# Altium project DA1_prj.PrjPcb (part 1 of 2)
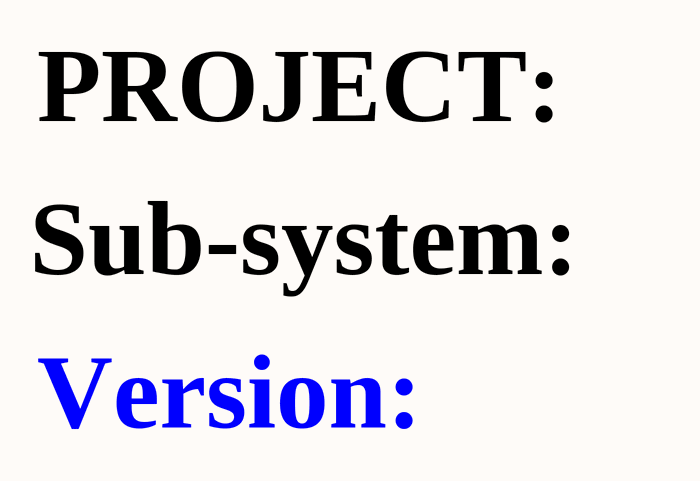
[diagram p0: COVER PAGE.SchDoc]
11 sheets, 279 parts. Net scope: flat (ports and power ports of the same name join across sheets).
Board file: PCB1.PcbDoc
Sheets:
  COVER PAGE.SchDoc
  INDEX.SchDoc
  STM32_PLC.SchDoc
  INPUT.SchDoc
  DIGTITAL.SchDoc
  DSDADC.SchDoc
  PULSE.SchDoc
  CAN.SchDoc
  SDADC.SchDoc
  DAC.SchDoc
  LED.SchDoc

## Sheet COVER PAGE.SchDoc: COVER PAGE
size 420 x 297 mm; Date: March 14; CheckedBy: ThS. Bùi Quốc Bảo; DrawnBy: Nguyễn Gia Huy; Revision: 1.0.0; SheetNumber: 1; SheetTotal: 6; MasterProject: STM32-PLC; Sub-system: DA1_prj.PrjPcb

### Notes on the sheet
- PROJECT:
- Sub-system:
- Version:
- Project:
- Design by:
- Sheet title:
- Sheet
- of
- Checked by:
- Approved by:
- Doc No:
- Revision:
- Size:
- Dates:
- A3

## Sheet INDEX.SchDoc: INDEX
size 420 x 297 mm; Date: March 14; CheckedBy: ThS. Bùi Quốc Bảo; DrawnBy: Nguyễn Gia Huy; Revision: V1.0; SheetNumber: 2; SheetTotal: 11; MasterProject: STM32 DEMO PCB; Sub-system: DA1_prj.PrjPcb
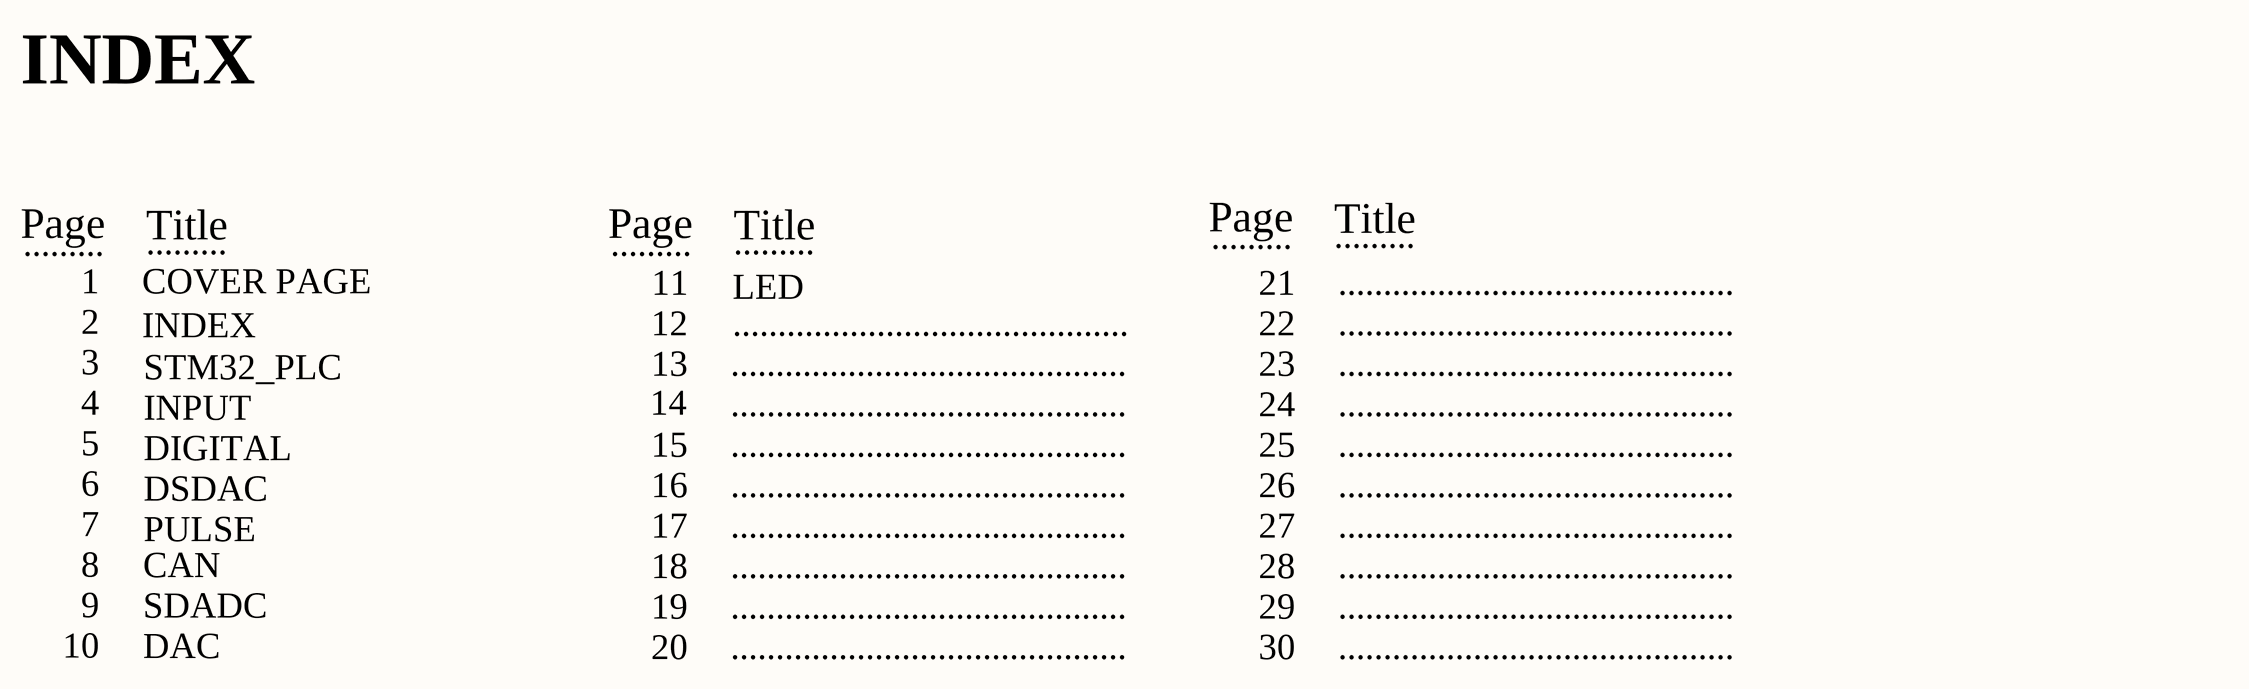
[diagram p1: INDEX.SchDoc]

### Notes on the sheet
- INDEX
- Page
- .........
- Title
- 1
- COVER PAGE
- 11
- LED
- 21
- ............................................
- 2
- 3
- STM32_PLC
- 12
- 13
- 22
- 23
- 4
- 5
- INPUT
- DIGITAL
- 14
- 15
- 24
- 25
- 6
- DSDAC
- 16
- 26
- 7
- 8
- CAN
- PULSE
- 17
- 18
- 27
- 28
- 9
- 10
- SDADC
- DAC
- 19
- 20
- 29
- 30
- Sub-system:
- Project:
- Design by:
- Sheet title:
- Sheet
- of
- Checked by:
- Approved by:
- Doc No:
- Revision:
- Size:
- Dates:
- A3

## Sheet STM32_PLC.SchDoc: STM32_PLC
size 420 x 297 mm; Date: March 14; CheckedBy: ThS. Bùi Quốc Bảo; DrawnBy: Nguyễn Gia Huy; Revision: V1.0; SheetNumber: 3; SheetTotal: 11; MasterProject: STM32-PLC; Sub-system: DA1_prj.PrjPcb
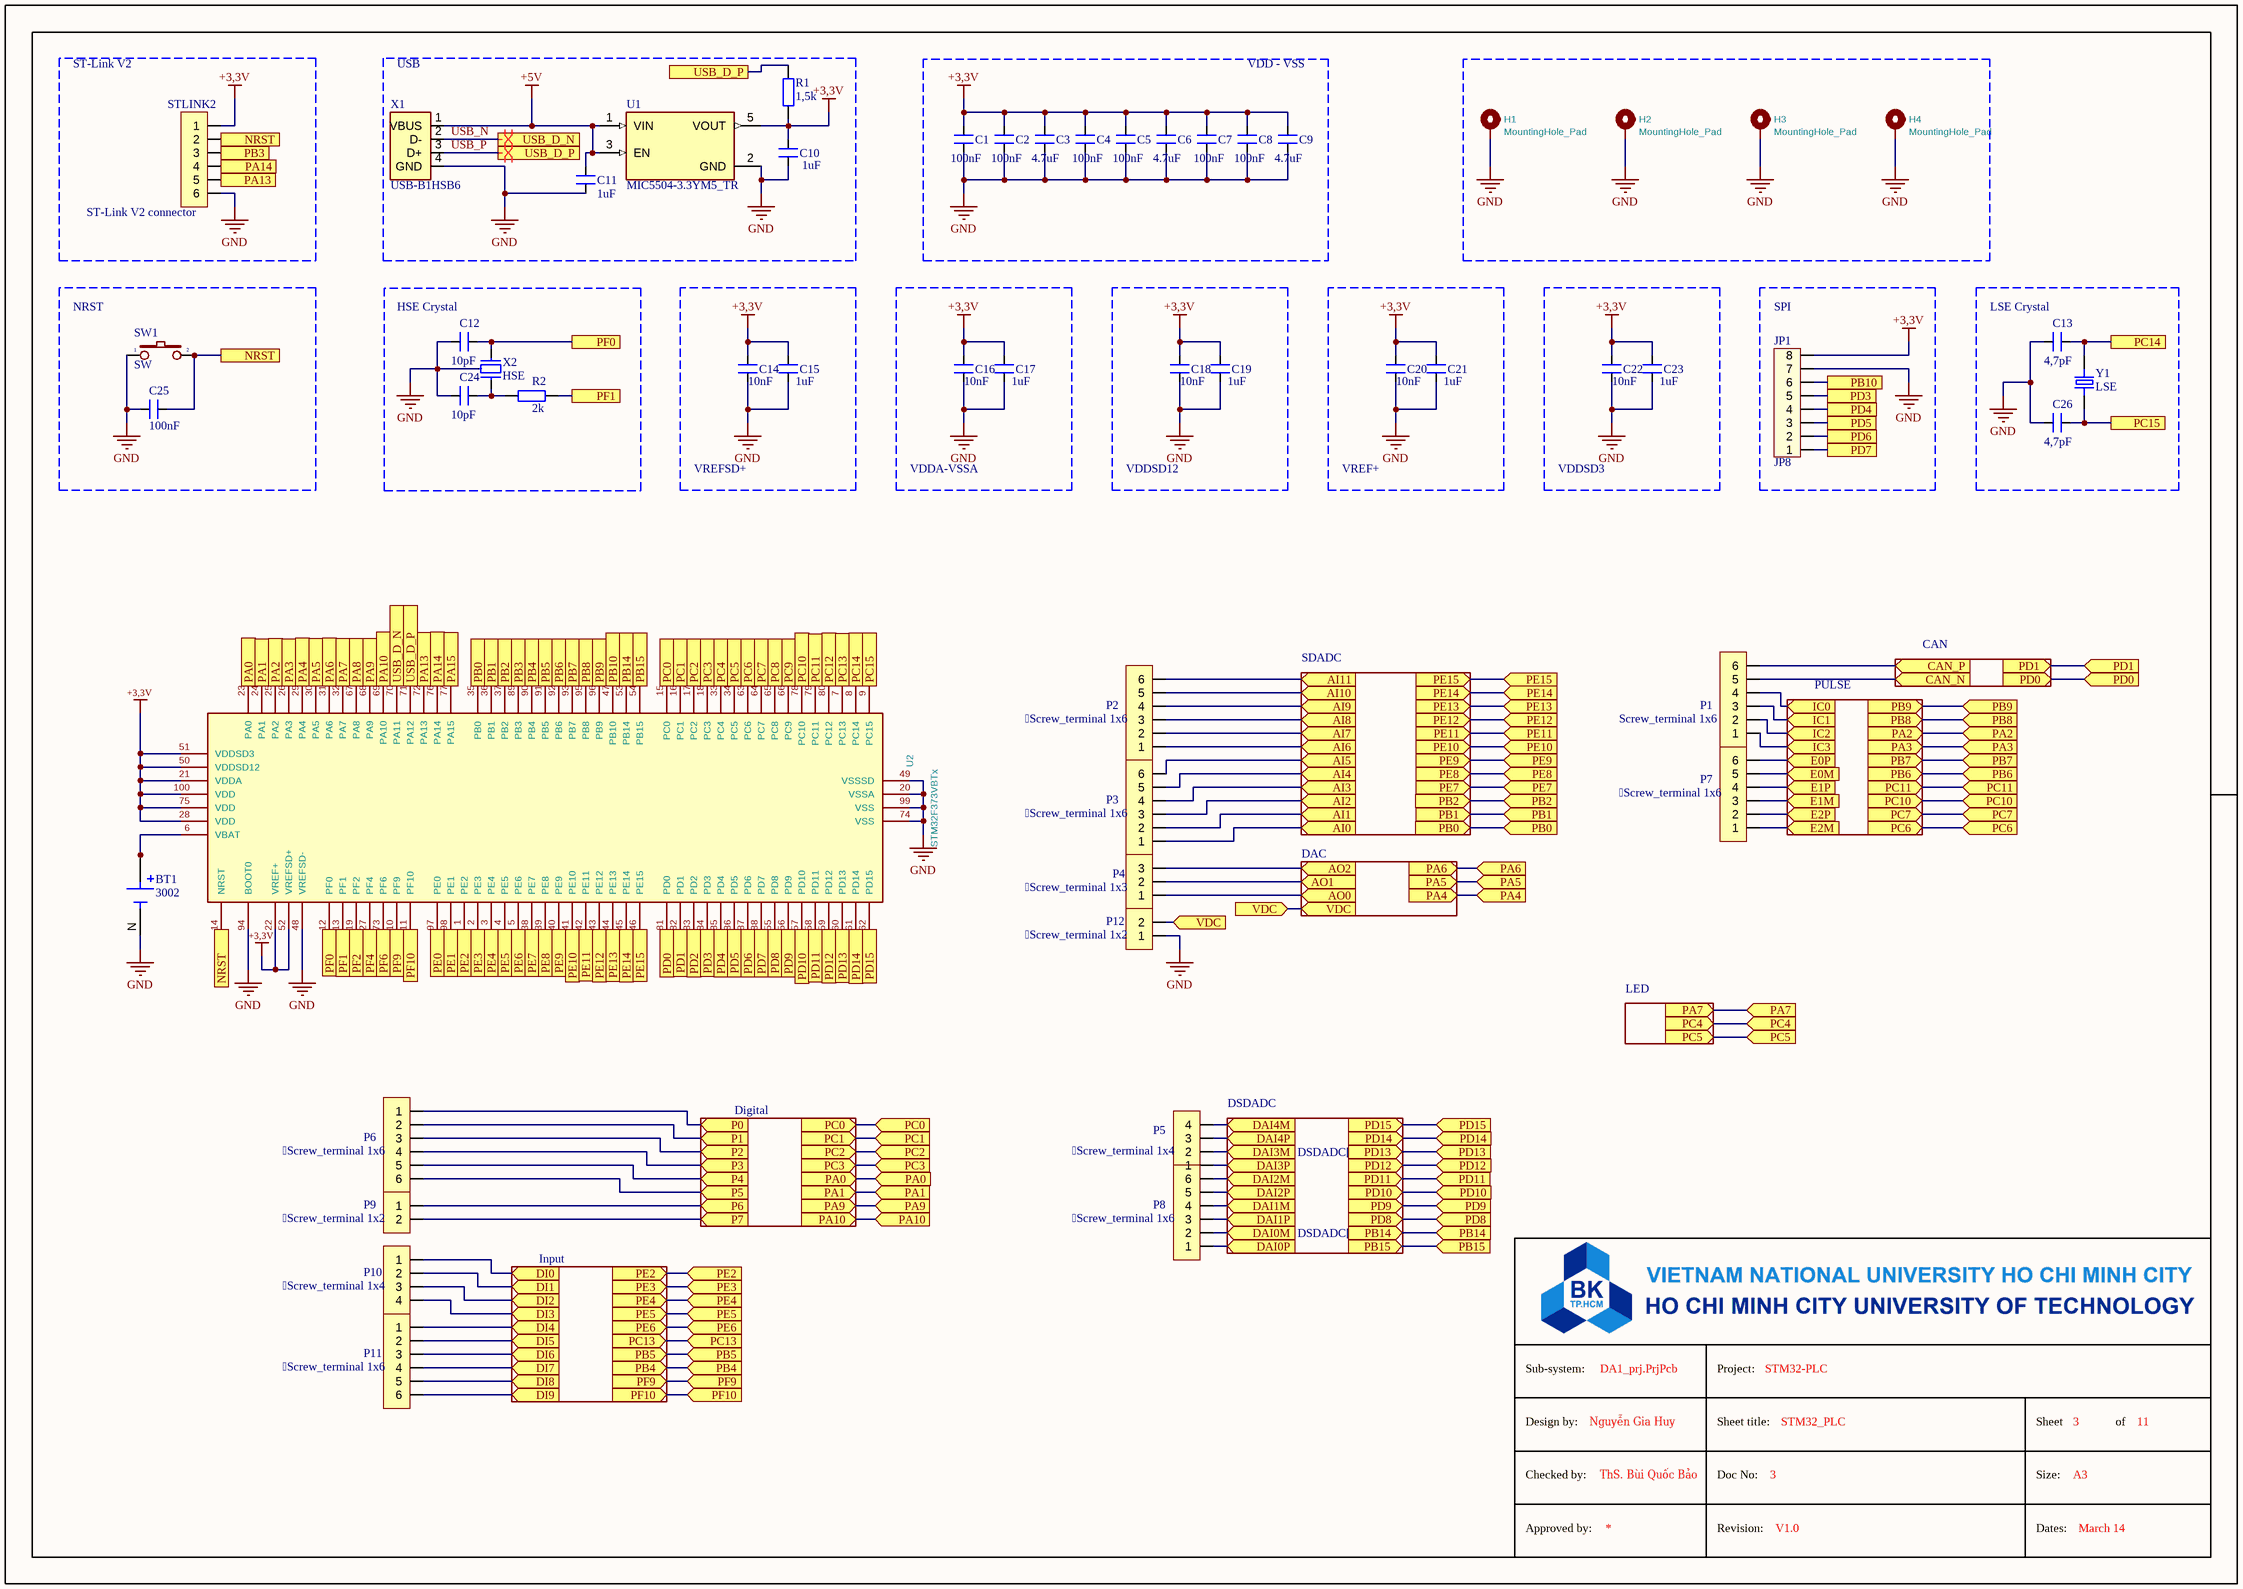
[diagram p2: STM32_PLC.SchDoc]

### Parts
BT1  3002  [BAT_3002]
C1  100nF  [FP-C0603C-CF-IPC_A]
C2  100nF  [FP-C0603C-CF-IPC_A]
C3  4.7uF  [FP-C0603C-CF-IPC_A]
C4  100nF  [FP-C0603C-CF-IPC_A]
C5  100nF  [FP-C0603C-CF-IPC_A]
C6  4.7uF  [FP-C0603C-CF-IPC_A]
C7  100nF  [FP-C0603C-CF-IPC_A]
C8  100nF  [FP-C0603C-CF-IPC_A]
C9  4.7uF  [FP-C0603C-CF-IPC_A]
C10  1uF  [FP-C0603C-CF-IPC_A]
C11  1uF  [FP-C0603C-CF-IPC_A]
C12  10pF  [FP-C0603C-CF-IPC_A]
C13  4,7pF  [FP-C0603C-CF-IPC_A]
C14  10nF  [FP-C0603C-CF-IPC_A]
C15  1uF  [FP-C0603C-CF-IPC_A]
C16  10nF  [FP-C0603C-CF-IPC_A]
C17  1uF  [FP-C0603C-CF-IPC_A]
C18  10nF  [FP-C0603C-CF-IPC_A]
C19  1uF  [FP-C0603C-CF-IPC_A]
C20  10nF  [FP-C0603C-CF-IPC_A]
C21  1uF  [FP-C0603C-CF-IPC_A]
C22  10nF  [FP-C0603C-CF-IPC_A]
C23  1uF  [FP-C0603C-CF-IPC_A]
C24  10pF  [FP-C0603C-CF-IPC_A]
C25  100nF  [FP-C0603C-CF-IPC_A]
C26  4,7pF  [FP-C0603C-CF-IPC_A]
H1  MountingHole_Pad  [MountingHole_2.7mm_M2.5_DIN965_Pad]
H2  MountingHole_Pad  [MountingHole_2.7mm_M2.5_DIN965_Pad]
H3  MountingHole_Pad  [MountingHole_2.7mm_M2.5_DIN965_Pad]
H4  MountingHole_Pad  [MountingHole_2.7mm_M2.5_DIN965_Pad]
JP1  JP8  [HDR/Header/8]
P1  Screw_terminal 1x6  [HDR/Terminal/6]
P2  Screw_terminal 1x6  [HDR/Terminal/6]
P3  Screw_terminal 1x6  [HDR/Terminal/6]
P4  Screw_terminal 1x3  [HDR/Terminal/3]
P5  Screw_terminal 1x4  [HDR/Terminal/4]
P6  Screw_terminal 1x6  [HDR/Terminal/6]
P7  Screw_terminal 1x6  [HDR/Terminal/6]
P8  Screw_terminal 1x6  [HDR/Terminal/6]
P9  Screw_terminal 1x2  [HDR/Terminal/2]
P10  Screw_terminal 1x4  [HDR/Terminal/4]
P11  Screw_terminal 1x6  [HDR/Terminal/6]
P12  Screw_terminal 1x2  [HDR/Terminal/2]
R1  1,5k  [tro smd 0603]
R2  2k  [tro smd 0603]
STLINK2  ST-Link V2 connector  [HDR/Header/6]
SW1  SW  [SW1-SMD]
U1  MIC5504-3.3YM5_TR  [SOT95P280X145-5N]
U2  STM32F373VBTx  [QFP50P1600X1600X160-100N]
X1  USB-B1HSB6  [OST_USB-B1HSB6]
X2  HSE  [XT3]
Y1  LSE  [XTAL_ECS-.327-7-34B-TR]

### Blocks framed on the sheet
ST-Link V2: STLINK2
USB: C10 C11 R1 U1 X1
VDD - VSS: C1-C9
NRST: C25 SW1
HSE Crystal: C12 C24 R2 X2
VREFSD+: C14 C15
VDDA-VSSA: C16 C17
VDDSD12: C18 C19
VREF+: C20 C21
VDDSD3: C22 C23
SPI: JP1
LSE Crystal: C13 C26 Y1

### Ports
AI0 (in, see SDADC[4C]), AI1 (in, see SDADC[4B]), AI2 (in, see SDADC[4B]), AI3 (in, see SDADC[4A]), AI4 (in, see SDADC[3C]), AI5 (in, see SDADC[3B]), AI6 (in, see SDADC[3B]), AI7 (in, see SDADC[3A]), AI8 (in, see SDADC[1C]), AI9 (in, see SDADC[1B]), AI10 (in, see SDADC[1B]), AI11 (in, see SDADC[1A]), AO0 (in, see DAC[3B]), AO1 (in, see DAC[3D]), AO2 (in, see DAC[5B]), CAN_N (in, see CAN[4B]), CAN_P (in, see CAN[4B]), DAI0M (in, see DSDADC[4B]), DAI0P (in, see DSDADC[4A]), DAI1M (in, see DSDADC[3C]), DAI1P (in, see DSDADC[3C]), DAI2M (in, see DSDADC[3A]), DAI2P (in, see DSDADC[3B]), DAI3M (in, see DSDADC[2C]), DAI3P (in, see DSDADC[2C]), DAI4M (in, see DSDADC[2A]), DAI4P (in, see DSDADC[2B]), DI0 (in, see INPUT[1C], INPUT[3D]), DI1 (in, see INPUT[1C], INPUT[3C]), DI2 (in, see INPUT[1C], INPUT[3B]), DI3 (in, see INPUT[1C], INPUT[3B]), DI4 (in, see INPUT[1B], INPUT[3A]), DI5 (in, see INPUT[1B], INPUT[2D]), DI6 (in, see INPUT[1B], INPUT[2C]), DI7 (in, see INPUT[1B], INPUT[2B]), DI8 (in, see INPUT[1B], INPUT[2B]), DI9 (in, see INPUT[1B], INPUT[2A]), E0M (in, see PULSE[3B]), E0P (in, see PULSE[3A]), E1M (in, see PULSE[3C]), E1P (in, see PULSE[3C]), E2M (in, see PULSE[5B]), E2P (in, see PULSE[5A]), IC0 (in, see PULSE[1A]), IC1 (in, see PULSE[1B]), IC2 (in, see PULSE[1C]), IC3 (in, see PULSE[1C]), NRST (in, see STM32_PLC[1A]), NRST (see STM32_PLC[1A], STM32_PLC[1C]), P0 (in, see DIGTITAL[2A]), P1 (in, see DIGTITAL[4B]), P2 (in, see DIGTITAL[4B]), P3 (in, see DIGTITAL[2B]), P4 (in, see DIGTITAL[2B]), P5 (in, see DIGTITAL[5A]), P6 (in, see DIGTITAL[4A]), P7 (in, see DIGTITAL[5B]), PA0 (in, see DIGTITAL[1C], STM32_PLC[1B], STM32_PLC[3C]), PA0 (in, see DIGTITAL[1C], STM32_PLC[3C]), PA1 (in, see DIGTITAL[4A], STM32_PLC[1B], STM32_PLC[3D]), PA1 (in, see DIGTITAL[4A], STM32_PLC[3D]), PA2 (in, see PULSE[2C], STM32_PLC[1B], STM32_PLC[6B]), PA2 (in, see PULSE[2C], STM32_PLC[6B]), PA3 (in, see PULSE[2C], STM32_PLC[1B], STM32_PLC[6B]), PA3 (in, see PULSE[2C], STM32_PLC[6B]), PA4 (in, see DAC[2B], STM32_PLC[1B], STM32_PLC[4C]), PA4 (in, see DAC[2B], STM32_PLC[4C]), PA5 (in, see DAC[2C], STM32_PLC[1B], STM32_PLC[4C]), PA5 (in, see DAC[2C], STM32_PLC[4C]), PA6 (in, see DAC[4B], STM32_PLC[1B], STM32_PLC[4C]), PA6 (in, see DAC[4B], STM32_PLC[4C]), PA7 (in, see LED[3B], STM32_PLC[1B], STM32_PLC[5C]), PA7 (in, see LED[3B], STM32_PLC[5C]), PA8 (in), PA9 (in, see DIGTITAL[3A], STM32_PLC[1B], STM32_PLC[3D]), PA9 (in, see DIGTITAL[3A], STM32_PLC[3D]), PA10 (in, see DIGTITAL[4B], STM32_PLC[2B], STM32_PLC[3D]), PA10 (in, see DIGTITAL[4B], STM32_PLC[3D]), PA13 (in, see STM32_PLC[1A]), PA13 (see STM32_PLC[2B]), PA14 (in, see STM32_PLC[1A]), PA14 (see STM32_PLC[2B]), PA15 (in), PB0 (in, see SDADC[5C], STM32_PLC[2B], STM32_PLC[4C]), PB0 (in, see SDADC[5C], STM32_PLC[2B], STM32_PLC[5C]), PB0 (in, see SDADC[5C], STM32_PLC[4C], STM32_PLC[5C]), PB1 (in, see SDADC[5B], STM32_PLC[2B], STM32_PLC[4C]), PB1 (in, see SDADC[5B], STM32_PLC[2B], STM32_PLC[5C]), PB1 (in, see SDADC[5B], STM32_PLC[4C], STM32_PLC[5C]), PB2 (in, see SDADC[5B], STM32_PLC[2B], STM32_PLC[4C]), PB2 (in, see SDADC[5B], STM32_PLC[2B], STM32_PLC[5C]), PB2 (in, see SDADC[5B], STM32_PLC[4C], STM32_PLC[5C]), PB3 (in, see STM32_PLC[1A]), PB3 (see STM32_PLC[2B]), PB4 (in, see INPUT[3B], STM32_PLC[2B], STM32_PLC[2D]), PB4 (in, see INPUT[3B], STM32_PLC[2D]), PB5 (in, see INPUT[3C], STM32_PLC[2B], STM32_PLC[2D]), PB5 (in, see INPUT[3C], STM32_PLC[2D]), PB6 (in, see PULSE[4B], STM32_PLC[2B], STM32_PLC[6B]), PB6 (in, see PULSE[4B], STM32_PLC[6B]), PB7 (in, see PULSE[4A], STM32_PLC[2B], STM32_PLC[6B]), PB7 (in, see PULSE[4A], STM32_PLC[6B]), PB8 (in, see PULSE[2B], STM32_PLC[2B], STM32_PLC[6B]), PB8 (in, see PULSE[2B], STM32_PLC[6B]), PB9 (in, see PULSE[2A], STM32_PLC[2B], STM32_PLC[6B]), PB9 (in, see PULSE[2A], STM32_PLC[6B]), PB10 (in, see STM32_PLC[5A]), PB10 (see STM32_PLC[2B]), PB14 (in, see DSDADC[5A], STM32_PLC[2B], STM32_PLC[4D]), PB14 (in, see DSDADC[5A], STM32_PLC[4D]), PB15 (in, see DSDADC[5B], STM32_PLC[2B], STM32_PLC[4D]), PB15 (in, see DSDADC[5B], STM32_PLC[4D]), PC0 (in, see DIGTITAL[1A], STM32_PLC[2B], STM32_PLC[3C]), PC0 (in, see DIGTITAL[1A], STM32_PLC[3C]), PC1 (in, see DIGTITAL[3B], STM32_PLC[2B], STM32_PLC[3C]), PC1 (in, see DIGTITAL[3B], STM32_PLC[3C]), PC2 (in, see DIGTITAL[3C], STM32_PLC[2B], STM32_PLC[3C]), PC2 (in, see DIGTITAL[3C], STM32_PLC[3C]), PC3 (in, see DIGTITAL[1B], STM32_PLC[2B], STM32_PLC[3C]), PC3 (in, see DIGTITAL[1B], STM32_PLC[3C]), PC4 (in, see LED[3B], STM32_PLC[2B], STM32_PLC[5C]), PC4 (in, see LED[3B], STM32_PLC[5C]), PC5 (in, see LED[3C], STM32_PLC[2B], STM32_PLC[5C]), PC5 (in, see LED[3C], STM32_PLC[5C]), PC6 (in, see PULSE[6B], STM32_PLC[2B], STM32_PLC[6C]), PC6 (in, see PULSE[6B], STM32_PLC[6C]), PC7 (in, see PULSE[6A], STM32_PLC[3B], STM32_PLC[6C]), PC7 (in, see PULSE[6A], STM32_PLC[6C]), PC8 (in), PC9 (in), PC10 (in, see PULSE[4C], STM32_PLC[3B], STM32_PLC[6C]), PC10 (in, see PULSE[4C], STM32_PLC[6C]), PC11 (in, see PULSE[4C], STM32_PLC[3B], STM32_PLC[6B]), PC11 (in, see PULSE[4C], STM32_PLC[6B]), PC12 (in), PC13 (in, see INPUT[3D], STM32_PLC[2D]), PC13 (in, see INPUT[3D], STM32_PLC[2D], STM32_PLC[3B]), PC14 (in, see STM32_PLC[6A]), PC14 (see STM32_PLC[3B]), PC15 (in, see STM32_PLC[6B]), PC15 (see STM32_PLC[3B]), PD0 (in, see CAN[2C], STM32_PLC[2C], STM32_PLC[6B]), PD0 (in, see CAN[2C], STM32_PLC[6B]), PD1 (in, see CAN[2C], STM32_PLC[2C], STM32_PLC[6B]), PD1 (in, see CAN[2C], STM32_PLC[6B]), PD2 (in), PD3 (in, see STM32_PLC[5A]), PD3 (see STM32_PLC[2C]), PD4 (in, see STM32_PLC[5B]), PD4 (see STM32_PLC[2C]), PD5 (in, see STM32_PLC[5B]), PD5 (see STM32_PLC[2C]), PD6 (in, see STM32_PLC[5B]), PD6 (see STM32_PLC[2C]), PD7 (in, see STM32_PLC[5B]), PD7 (see STM32_PLC[3C]), PD8 (in, see DSDADC[4C], STM32_PLC[3C], STM32_PLC[4D]), PD8 (in, see DSDADC[4C], STM32_PLC[4D]), PD9 (in, see DSDADC[4C], STM32_PLC[3C], STM32_PLC[4D]), PD9 (in, see DSDADC[4C], STM32_PLC[4D]), PD10 (in, see DSDADC[4B], STM32_PLC[3C], STM32_PLC[4D]), PD10 (in, see DSDADC[4B], STM32_PLC[4D]), PD11 (in, see DSDADC[4A], STM32_PLC[3C], STM32_PLC[4C]), PD11 (in, see DSDADC[4A], STM32_PLC[4C]), PD12 (in, see DSDADC[2C], STM32_PLC[3C], STM32_PLC[4C]), PD12 (in, see DSDADC[2C], STM32_PLC[4C]), PD13 (in, see DSDADC[2C], STM32_PLC[3C], STM32_PLC[4C]), PD13 (in, see DSDADC[2C], STM32_PLC[4C]), PD14 (in, see DSDADC[2B], STM32_PLC[3C], STM32_PLC[4C]), PD14 (in, see DSDADC[2B], STM32_PLC[4C]), PD15 (in, see DSDADC[2A], STM32_PLC[3C], STM32_PLC[4C]), PD15 (in, see DSDADC[2A], STM32_PLC[4C]), PE0 (in), PE1 (in), PE2 (in, see INPUT[4D], STM32_PLC[2C], STM32_PLC[2D]), PE2 (in, see INPUT[4D], STM32_PLC[2D]), PE3 (in, see INPUT[4C], STM32_PLC[2C], STM32_PLC[2D]), PE3 (in, see INPUT[4C], STM32_PLC[2D]), PE4 (in, see INPUT[4B], STM32_PLC[2C], STM32_PLC[2D]), PE4 (in, see INPUT[4B], STM32_PLC[2D]), PE5 (in, see INPUT[4B], STM32_PLC[2C], STM32_PLC[2D]), PE5 (in, see INPUT[4B], STM32_PLC[2D]), PE6 (in, see INPUT[4A], STM32_PLC[2C], STM32_PLC[2D]), PE6 (in, see INPUT[4A], STM32_PLC[2D]), PE7 (in, see SDADC[5A], STM32_PLC[2C], STM32_PLC[4B]), PE7 (in, see SDADC[5A], STM32_PLC[2C], STM32_PLC[5B]), PE7 (in, see SDADC[5A], STM32_PLC[4B], STM32_PLC[5B]), PE8 (in, see SDADC[3C], STM32_PLC[2C], STM32_PLC[4B]), PE8 (in, see SDADC[3C], STM32_PLC[2C], STM32_PLC[5B]), PE8 (in, see SDADC[3C], STM32_PLC[4B], STM32_PLC[5B]), PE9 (in, see SDADC[3B], STM32_PLC[2C], STM32_PLC[4B]), PE9 (in, see SDADC[3B], STM32_PLC[2C], STM32_PLC[5B]), PE9 (in, see SDADC[3B], STM32_PLC[4B], STM32_PLC[5B]), PE10 (in, see SDADC[3B], STM32_PLC[2C], STM32_PLC[4B]), PE10 (in, see SDADC[3B], STM32_PLC[2C], STM32_PLC[5B]), PE10 (in, see SDADC[3B], STM32_PLC[4B], STM32_PLC[5B]), PE11 (in, see SDADC[3A], STM32_PLC[2C], STM32_PLC[4B]), PE11 (in, see SDADC[3A], STM32_PLC[2C], STM32_PLC[5B]), PE11 (in, see SDADC[3A], STM32_PLC[4B], STM32_PLC[5B]), PE12 (in, see SDADC[2C], STM32_PLC[2C], STM32_PLC[4B]), PE12 (in, see SDADC[2C], STM32_PLC[2C], STM32_PLC[5B]), PE12 (in, see SDADC[2C], STM32_PLC[4B], STM32_PLC[5B]), PE13 (in, see SDADC[2B], STM32_PLC[2C], STM32_PLC[4B]), PE13 (in, see SDADC[2B], STM32_PLC[2C], STM32_PLC[5B]), PE13 (in, see SDADC[2B], STM32_PLC[4B], STM32_PLC[5B]), PE14 (in, see SDADC[2B], STM32_PLC[2C], STM32_PLC[4B]), PE14 (in, see SDADC[2B], STM32_PLC[2C], STM32_PLC[5B]), PE14 (in, see SDADC[2B], STM32_PLC[4B], STM32_PLC[5B]), PE15 (in, see SDADC[2A], STM32_PLC[2C], STM32_PLC[4B]), PE15 (in, see SDADC[2A], STM32_PLC[2C], STM32_PLC[5B]), PE15 (in, see SDADC[2A], STM32_PLC[4B], STM32_PLC[5B]), PF0 (in, see STM32_PLC[2A]), PF0 (see STM32_PLC[1C]), PF1 (in, see STM32_PLC[2A]), PF1 (see STM32_PLC[1C]), PF2 (in), PF4 (in), PF6 (in), PF9 (in, see INPUT[3B], STM32_PLC[2C], STM32_PLC[2D]), PF9 (in, see INPUT[3B], STM32_PLC[2D]), PF10 (in, see INPUT[3A], STM32_PLC[2C], STM32_PLC[2D]), PF10 (in, see INPUT[3A], STM32_PLC[2D]), USB_D_N (in, see STM32_PLC[2A]), USB_D_N (see STM32_PLC[2B]), USB_D_P (in, see STM32_PLC[2A]), USB_D_P (see STM32_PLC[2A], STM32_PLC[2B]), VDC (in, see DAC[1A], DAC[2A], DAC[3B], DAC[3C], DAC[5B], STM32_PLC[4C])

### Nets
+3,3V: C1.2 C2.2 C3.2 C4.2 C5.2 C6.2 C7.2 C8.2 C9.2 C10.2 C14.2 C15.2 C16.2 C17.2 C18.2 C19.2 C20.2 C21.2 C22.2 C23.2 JP1.8 R1.1 STLINK2.1 U1.5(VOUT) U2.21(VDDA) U2.22(VREF+) U2.28(VDD) U2.50(VDDSD12) U2.51(VDDSD3) U2.52(VREFSD+) U2.75(VDD) U2.100(VDD)
+5V: C11.2 U1.1(VIN) U1.3(EN) X1.1(VBUS)
GND: BT1.N(NEG) C1.1 C2.1 C3.1 C4.1 C5.1 C6.1 C7.1 C8.1 C9.1 C10.1 C11.1 C12.2 C13.2 C14.1 C15.1 C16.1 C17.1 C18.1 C19.1 C20.1 C21.1 C22.1 C23.1 C24.2 C25.2 C26.2 H1.1 H2.1 H3.1 H4.1 JP1.7 P12.1 STLINK2.6 SW1.1 U1.2(GND) U2.20(VSSA) U2.48(VREFSD-) U2.49(VSSSD) U2.74(VSS) U2.94(BOOT0) U2.99(VSS) X1.4(GND) X2.3
USB_N: U2.70(PA11) X1.2(D-) ; port USB_D_N
USB_P: R1.2 U2.71(PA12) X1.3(D+) ; port USB_D_P
VDC: P12.2 ; port VDC
NetBT1_P1: BT1.P1(POS) BT1.P2(POS) U2.6(VBAT)
NetC12_1: C12.1 U2.12(PF0) X2.1 ; port PF0
NetC13_1: C13.1 U2.8(PC14) Y1.2 ; port PC14
NetC24_1: C24.1 R2.2 X2.2
NetC25_1: C25.1 STLINK2.2 SW1.2 U2.14(NRST) ; port NRST
NetC26_1: C26.1 U2.9(PC15) Y1.1 ; port PC15
NetC27_2: P1.6 ; port CAN_P
NetC29_1: U2.81(PD0) ; port PD0
NetC31_2: U2.82(PD1) ; port PD1
NetC32_2: P1.5 ; port CAN_N
NetC34_1: U2.29(PA4) ; port PA4
NetC35_1: U2.31(PA6) ; port PA6
NetC36_1: U2.30(PA5) ; port PA5
NetD2_3: U2.62(PD15) ; port PD15
NetD3_3: U2.58(PD11) ; port PD11
NetD4_3: U2.53(PB14) ; port PB14
NetD5_3: U2.61(PD14) ; port PD14
NetD6_3: U2.57(PD10) ; port PD10
NetD7_3: U2.54(PB15) ; port PB15
NetD8_3: U2.60(PD13) ; port PD13
NetD9_3: U2.56(PD9) ; port PD9
NetD10_3: U2.59(PD12) ; port PD12
NetD11_3: U2.55(PD8) ; port PD8
NetD12_3: U2.46(PE15) ; port PE15
NetD13_3: U2.42(PE11) ; port PE11
NetD14_3: U2.38(PE7) ; port PE7
NetD15_3: U2.45(PE14) ; port PE14
NetD16_3: U2.41(PE10) ; port PE10
NetD17_3: U2.37(PB2) ; port PB2
NetD18_3: U2.44(PE13) ; port PE13
NetD19_3: U2.40(PE9) ; port PE9
NetD20_3: U2.36(PB1) ; port PB1
NetD21_3: U2.43(PE12) ; port PE12
NetD22_3: U2.39(PE8) ; port PE8
NetD23_3: U2.35(PB0) ; port PB0
NetF1_1: P6.1 ; port P0
NetF2_1: P9.1 ; port P6
NetF3_1: P6.6 ; port P5
NetF4_1: P6.4 ; port P3
NetF5_1: P6.2 ; port P1
NetF6_1: P9.2 ; port P7
NetF7_1: P6.5 ; port P4
NetF8_1: P6.3 ; port P2
NetF9_2: P5.4 ; port DAI4M
NetF10_2: P8.6 ; port DAI2M
NetF11_2: P8.1 ; port DAI0P
NetF12_2: P5.3 ; port DAI4P
NetF13_2: P8.5 ; port DAI2P
NetF14_2: P8.2 ; port DAI0M
NetF15_2: P5.2 ; port DAI3M
NetF16_2: P8.4 ; port DAI1M
NetF17_2: P5.1 ; port DAI3P
NetF18_2: P8.3 ; port DAI1P
NetF19_2: P2.6 ; port AI11
NetF20_2: P2.2 ; port AI7
NetF21_2: P3.4 ; port AI3
NetF22_2: P2.5 ; port AI10
NetF23_2: P2.1 ; port AI6
NetF24_2: P3.3 ; port AI2
NetF25_2: P2.4 ; port AI9
NetF26_2: P3.6 ; port AI5
NetF27_2: P3.2 ; port AI1
NetF28_2: P2.3 ; port AI8
NetF29_2: P3.5 ; port AI4
NetF30_2: P3.1 ; port AI0
NetJP1_1: JP1.1 U2.88(PD7) ; port PD7
NetJP1_2: JP1.2 U2.87(PD6) ; port PD6
NetJP1_3: JP1.3 U2.86(PD5) ; port PD5
NetJP1_4: JP1.4 U2.85(PD4) ; port PD4
NetJP1_5: JP1.5 U2.84(PD3) ; port PD3
NetJP1_6: JP1.6 U2.47(PB10) ; port PB10
NetP1_1: P1.1 ; port IC3
NetP1_2: P1.2 ; port IC2
NetP1_3: P1.3 ; port IC1
NetP1_4: P1.4 ; port IC0
NetP4_1: P4.1 ; port AO0
NetP4_2: P4.2 ; port AO1
NetP4_3: P4.3 ; port AO2
NetP7_1: P7.1 ; port E2M
NetP7_2: P7.2 ; port E2P
NetP7_3: P7.3 ; port E1M
NetP7_4: P7.4 ; port E1P
NetP7_5: P7.5 ; port E0M
NetP7_6: P7.6 ; port E0P
NetP10_1: P10.1 ; port DI0
NetP10_2: P10.2 ; port DI1
NetP10_3: P10.3 ; port DI2
NetP10_4: P10.4 ; port DI3
NetP11_1: P11.1 ; port DI4
NetP11_2: P11.2 ; port DI5
NetP11_3: P11.3 ; port DI6
NetP11_4: P11.4 ; port DI7
NetP11_5: P11.5 ; port DI8
NetP11_6: P11.6 ; port DI9
NetR2_1: R2.1 U2.13(PF1) ; port PF1
NetR8_1: U2.11(PF10) ; port PF10
NetR10_1: U2.5(PE6) ; port PE6
NetR12_1: U2.10(PF9) ; port PF9
NetR14_1: U2.4(PE5) ; port PE5
NetR16_1: U2.90(PB4) ; port PB4
NetR18_1: U2.3(PE4) ; port PE4
NetR20_1: U2.91(PB5) ; port PB5
NetR22_1: U2.2(PE3) ; port PE3
NetR24_1: U2.7(PC13) ; port PC13
NetR26_1: U2.1(PE2) ; port PE2
NetR27_1: U2.15(PC0) ; port PC0
NetR28_1: U2.68(PA9) ; port PA9
NetR29_1: U2.24(PA1) ; port PA1
NetR33_1: U2.18(PC3) ; port PC3
NetR34_1: U2.16(PC1) ; port PC1
NetR35_1: U2.69(PA10) ; port PA10
NetR39_1: U2.23(PA0) ; port PA0
NetR40_1: U2.17(PC2) ; port PC2
NetR122_1: U2.32(PA7) ; port PA7
NetR123_1: U2.33(PC4) ; port PC4
NetR124_1: U2.34(PC5) ; port PC5
NetSTLINK2_3: STLINK2.3 U2.89(PB3) ; port PB3
NetSTLINK2_4: STLINK2.4 U2.76(PA14) ; port PA14
NetSTLINK2_5: STLINK2.5 U2.72(PA13) ; port PA13
NetU2_19: U2.19(PF2) ; port PF2
NetU2_25: U2.25(PA2) ; port PA2
NetU2_26: U2.26(PA3) ; port PA3
NetU2_27: U2.27(PF4) ; port PF4
NetU2_63: U2.63(PC6) ; port PC6
NetU2_64: U2.64(PC7) ; port PC7
NetU2_65: U2.65(PC8) ; port PC8
NetU2_66: U2.66(PC9) ; port PC9
NetU2_67: U2.67(PA8) ; port PA8
NetU2_73: U2.73(PF6) ; port PF6
NetU2_77: U2.77(PA15) ; port PA15
NetU2_78: U2.78(PC10) ; port PC10
NetU2_79: U2.79(PC11) ; port PC11
NetU2_80: U2.80(PC12) ; port PC12
NetU2_83: U2.83(PD2) ; port PD2
NetU2_92: U2.92(PB6) ; port PB6
NetU2_93: U2.93(PB7) ; port PB7
NetU2_95: U2.95(PB8) ; port PB8
NetU2_96: U2.96(PB9) ; port PB9
NetU2_97: U2.97(PE0) ; port PE0
NetU2_98: U2.98(PE1) ; port PE1

### Layout directives
differential pair: USB_N, USB_P

### Notes on the sheet
- SDADC
- CAN
- PULSE
- DAC
- LED
- Digital
- (near P5) DSDADC
- Input
- Sub-system:
- Project:
- Design by:
- Sheet title:
- Sheet
- of
- Checked by:
- Approved by:
- Doc No:
- Revision:
- Size:
- Dates:
- A3

### Library data of the parts
BT1 = 3002: Battery Holder: SMT, 1 Coin Cell, 20mm, PhosBronze/Tin-Nickel | Keystone Electronics 3002; MF: Keystone Electronics Corp.; SnapEDA_Link: https://www.snapeda.com/parts/3002/Keystone/view-part/?ref=snap; Package: NON STANDARD-2 Keystone; Value: *; MP: 3002; Check_prices: https://www.snapeda.com/parts/3002/Keystone/view-part/?ref=eda
C1-C26 = CN-SEMI-DIP: Capacitor (Semiconductor SIM Model); Value: 104; LatestRevisionDate: 17-Jul-2002; LatestRevisionNote: Re-released for DXP Platform.; PackageReference: C1206; Publisher: Altium Limited
JP1 = Header8: Connector 8; Value: Connector 8
P1-P3 P6-P8 P11 STLINK2 = Header 6: Header, 6-Pin
P4 = Header 3: Header, 3-Pin
P5 P10 = Header 4: Header, 4-Pin
P9 P12 = Header 2: Header, 2-Pin
R1 R2 = Tro 0603 1% 10k: RES; Chung_Loai: Dán; Don_Vi: Con; So_Chan: 2; Ten_Linh_Kien: Trở 0603 1% 10k; Ma_Hang: MH006333; Kieu_Chan: *
SW1 = SW2: Switch button 2 pin; Value: SW chip 2 pin
U1 = MIC5504-3.3YM5_TR: Linear Voltage Regulator IC Positive Fixed 1 Output 300mA SOT-23-5; MF: Microchip; MP: MIC5504-3.3YM5 TR; SnapEDA_Link: https://www.snapeda.com/parts/MIC5504-3.3YM5%20TR/Microchip/view-part/?ref=snap; Package: SOT-23 Microchip; Value: *; Check_prices: https://www.snapeda.com/parts/MIC5504-3.3YM5%20TR/Microchip/view-part/?ref=eda
X1 = USB-B1HSB6: USB-B (USB TYPE-B) - Receptacle Connector 4 Position Through Hole, Right Angle; MF: On Shore; Check_prices: https://www.snapeda.com/parts/USB-B1HSB6/On+Shore+Technology+Inc./view-part/?ref=eda; Value: *; Purchase-URL: https://pricing.snapeda.com/search/part/USB-B1HSB6/?ref=eda; Price: None; MP: USB-B1HSB6; SnapEDA_Link: https://www.snapeda.com/parts/USB-B1HSB6/On+Shore+Technology+Inc./view-part/?ref=snap; Availability: In Stock; Package: None
X2 = XT3: Crystal For all Crystal 2pin.; Value: 4Mhz
Y1 = ECS-.327-7-34B-TR: 32.768 kHz Â±20ppm Crystal 7pF 70 kOhms 2-SMD, No Lead; MF: ECS Inc.; SnapEDA_Link: https://www.snapeda.com/parts/ECS-.327-7-34B-TR/ECS/view-part/?ref=snap; Package: ECX-31B-34B-2 ECS; Value: *; MP: ECS-.327-7-34B-TR; Check_prices: https://www.snapeda.com/parts/ECS-.327-7-34B-TR/ECS/view-part/?ref=eda
H1-H4 = MountingHole_Pad: Value: MountingHole_Pad; Footprint: MountingHole:MountingHole_2.7mm_M2.5_DIN965_Pad
U2 = STM32F373VBTx: Value: STM32F373VBTx; Footprint: Package_QFP:LQFP-100_14x14mm_P0.5mm

## Sheet INPUT.SchDoc: INPUT
size 420 x 297 mm; Date: March 14; CheckedBy: ThS. Bùi Quốc Bảo; DrawnBy: Nguyễn Gia Huy; Revision: V1.0; SheetNumber: 4; SheetTotal: 11; MasterProject: STM32-PLC; Sub-system: DA1_prj.PrjPcb
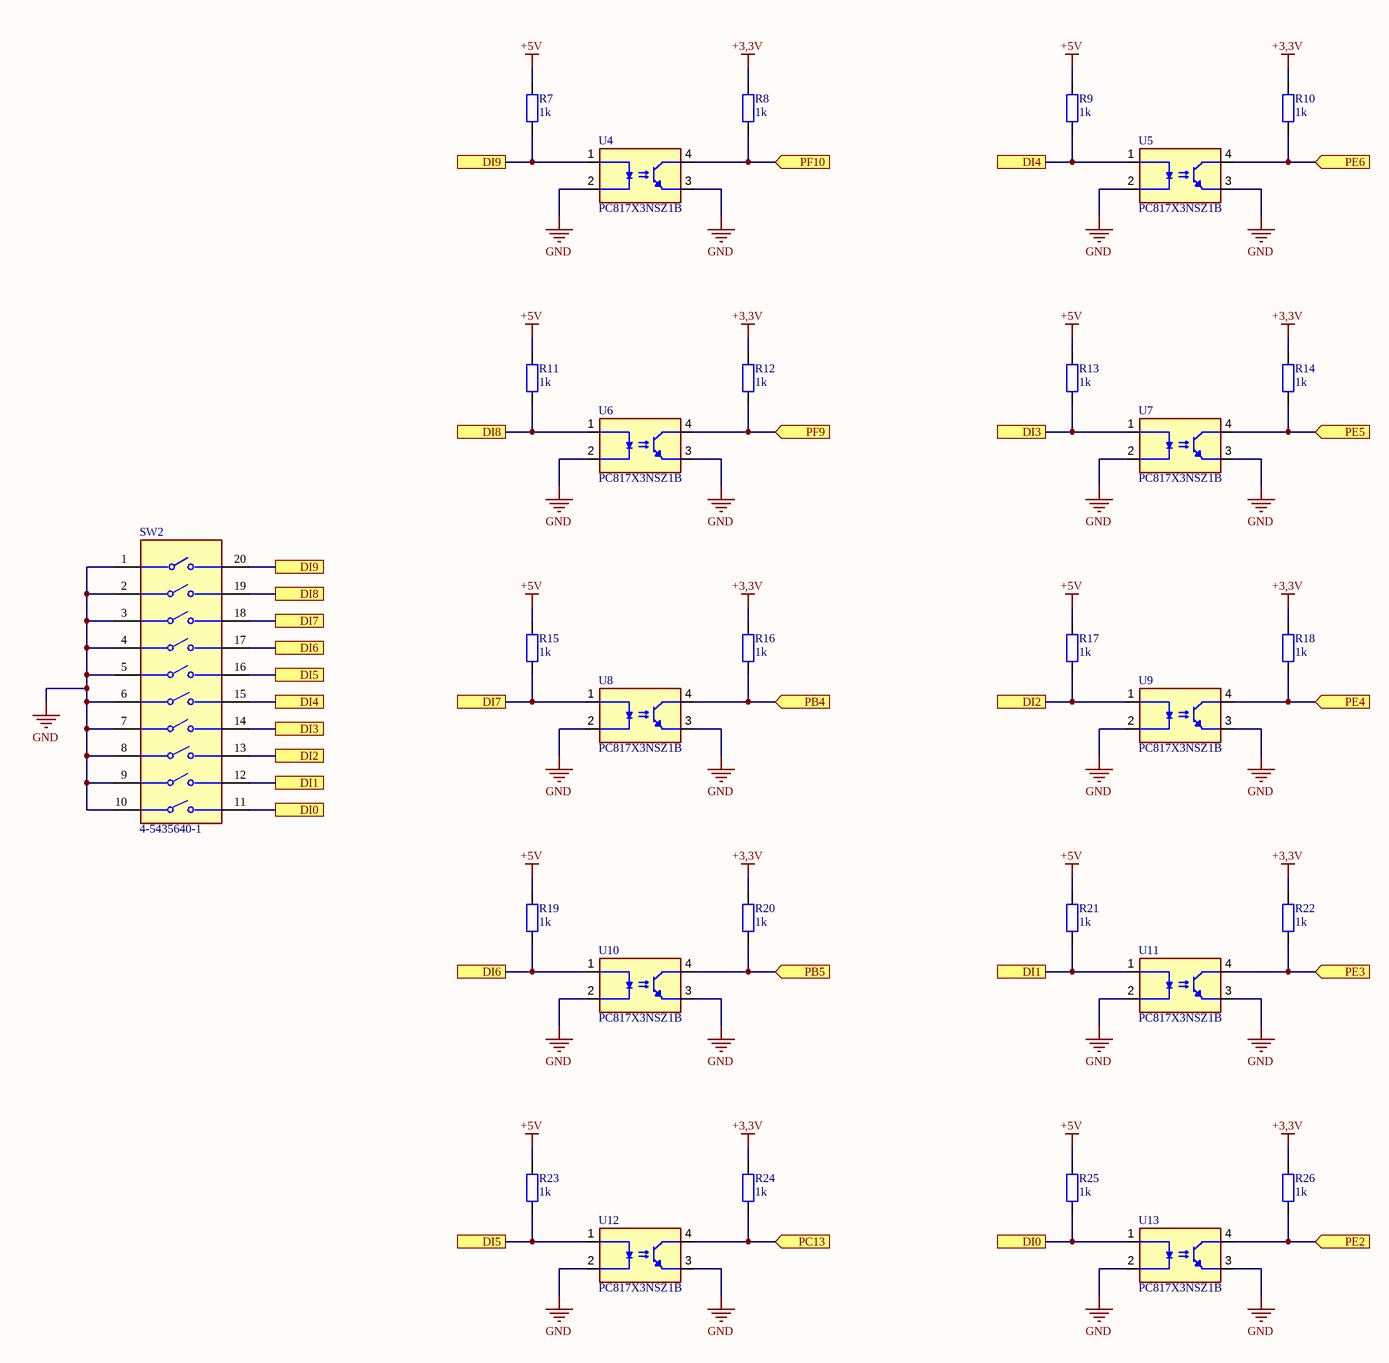
[diagram p3: INPUT.SchDoc]

### Parts
R7  1k  [tro smd 0603]
R8  1k  [tro smd 0603]
R9  1k  [tro smd 0603]
R10  1k  [tro smd 0603]
R11  1k  [tro smd 0603]
R12  1k  [tro smd 0603]
R13  1k  [tro smd 0603]
R14  1k  [tro smd 0603]
R15  1k  [tro smd 0603]
R16  1k  [tro smd 0603]
R17  1k  [tro smd 0603]
R18  1k  [tro smd 0603]
R19  1k  [tro smd 0603]
R20  1k  [tro smd 0603]
R21  1k  [tro smd 0603]
R22  1k  [tro smd 0603]
R23  1k  [tro smd 0603]
R24  1k  [tro smd 0603]
R25  1k  [tro smd 0603]
R26  1k  [tro smd 0603]
SW2  4-5435640-1  [FP-4-5435640-1-MFG]
U4  PC817X3NSZ1B  [DIP762W50P254L495H455Q4]
U5  PC817X3NSZ1B  [DIP762W50P254L495H455Q4]
U6  PC817X3NSZ1B  [DIP762W50P254L495H455Q4]
U7  PC817X3NSZ1B  [DIP762W50P254L495H455Q4]
U8  PC817X3NSZ1B  [DIP762W50P254L495H455Q4]
U9  PC817X3NSZ1B  [DIP762W50P254L495H455Q4]
U10  PC817X3NSZ1B  [DIP762W50P254L495H455Q4]
U11  PC817X3NSZ1B  [DIP762W50P254L495H455Q4]
U12  PC817X3NSZ1B  [DIP762W50P254L495H455Q4]
U13  PC817X3NSZ1B  [DIP762W50P254L495H455Q4]

### Ports
DI0 (see INPUT[1C], STM32_PLC[2D]), DI0 (see INPUT[3D], STM32_PLC[2D]), DI1 (see INPUT[1C], STM32_PLC[2D]), DI1 (see INPUT[3C], STM32_PLC[2D]), DI2 (see INPUT[1C], STM32_PLC[2D]), DI2 (see INPUT[3B], STM32_PLC[2D]), DI3 (see INPUT[1C], STM32_PLC[2D]), DI3 (see INPUT[3B], STM32_PLC[2D]), DI4 (see INPUT[1B], STM32_PLC[2D]), DI4 (see INPUT[3A], STM32_PLC[2D]), DI5 (see INPUT[1B], STM32_PLC[2D]), DI5 (see INPUT[2D], STM32_PLC[2D]), DI6 (see INPUT[1B], STM32_PLC[2D]), DI6 (see INPUT[2C], STM32_PLC[2D]), DI7 (see INPUT[1B], STM32_PLC[2D]), DI7 (see INPUT[2B], STM32_PLC[2D]), DI8 (see INPUT[1B], STM32_PLC[2D]), DI8 (see INPUT[2B], STM32_PLC[2D]), DI9 (see INPUT[1B], STM32_PLC[2D]), DI9 (see INPUT[2A], STM32_PLC[2D]), PB4 (in, see STM32_PLC[2B], STM32_PLC[2D]), PB5 (in, see STM32_PLC[2B], STM32_PLC[2D]), PC13 (in, see STM32_PLC[2D], STM32_PLC[3B]), PE2 (in, see STM32_PLC[2C], STM32_PLC[2D]), PE3 (in, see STM32_PLC[2C], STM32_PLC[2D]), PE4 (in, see STM32_PLC[2C], STM32_PLC[2D]), PE5 (in, see STM32_PLC[2C], STM32_PLC[2D]), PE6 (in, see STM32_PLC[2C], STM32_PLC[2D]), PF9 (in, see STM32_PLC[2C], STM32_PLC[2D]), PF10 (in, see STM32_PLC[2C], STM32_PLC[2D])

### Nets
+3,3V: R8.2 R10.2 R12.2 R14.2 R16.2 R18.2 R20.2 R22.2 R24.2 R26.2
+5V: R7.2 R9.2 R11.2 R13.2 R15.2 R17.2 R19.2 R21.2 R23.2 R25.2
GND: SW2.1 SW2.2 SW2.3 SW2.4 SW2.5 SW2.6 SW2.7 SW2.8 SW2.9 SW2.10 U4.2(CATHODE) U4.3(EMITTER) U5.2(CATHODE) U5.3(EMITTER) U6.2(CATHODE) U6.3(EMITTER) U7.2(CATHODE) U7.3(EMITTER) U8.2(CATHODE) U8.3(EMITTER) U9.2(CATHODE) U9.3(EMITTER) U10.2(CATHODE) U10.3(EMITTER) U11.2(CATHODE) U11.3(EMITTER) U12.2(CATHODE) U12.3(EMITTER) U13.2(CATHODE) U13.3(EMITTER)
NetP10_1: R25.1 SW2.11 U13.1(ANODE) ; port DI0
NetP10_2: R21.1 SW2.12 U11.1(ANODE) ; port DI1
NetP10_3: R17.1 SW2.13 U9.1(ANODE) ; port DI2
NetP10_4: R13.1 SW2.14 U7.1(ANODE) ; port DI3
NetP11_1: R9.1 SW2.15 U5.1(ANODE) ; port DI4
NetP11_2: R23.1 SW2.16 U12.1(ANODE) ; port DI5
NetP11_3: R19.1 SW2.17 U10.1(ANODE) ; port DI6
NetP11_4: R15.1 SW2.18 U8.1(ANODE) ; port DI7
NetP11_5: R11.1 SW2.19 U6.1(ANODE) ; port DI8
NetP11_6: R7.1 SW2.20 U4.1(ANODE) ; port DI9
NetR8_1: R8.1 U4.4(COLLECTOR) ; port PF10
NetR10_1: R10.1 U5.4(COLLECTOR) ; port PE6
NetR12_1: R12.1 U6.4(COLLECTOR) ; port PF9
NetR14_1: R14.1 U7.4(COLLECTOR) ; port PE5
NetR16_1: R16.1 U8.4(COLLECTOR) ; port PB4
NetR18_1: R18.1 U9.4(COLLECTOR) ; port PE4
NetR20_1: R20.1 U10.4(COLLECTOR) ; port PB5
NetR22_1: R22.1 U11.4(COLLECTOR) ; port PE3
NetR24_1: R24.1 U12.4(COLLECTOR) ; port PC13
NetR26_1: R26.1 U13.4(COLLECTOR) ; port PE2

### Notes on the sheet
- Sub-system:
- Project:
- Design by:
- Sheet title:
- Sheet
- of
- Checked by:
- Approved by:
- Doc No:
- Revision:
- Size:
- Dates:
- A3

### Library data of the parts
R7-R26 = Tro 0603 1% 10k: as R1 on sheet STM32_PLC; Kieu_Chan: *
SW2 = CMP-03400-000018-1: SWITCH ROCKER DIP SPST 60MA 5V; Number of Circuits: 10; Contact Post Length: 0.14inch; Washable: Yes; Contact Current Rating: 1A; Voltage Rating (DC): 40V; Sealable: Yes (With); Pitch: 0.1inch; Terminal Pitch: 2.54mm; Height: 0.34inch; Contact Plating: Gold; Mount: Through Hole; Orientation: Straight; Type: Switch; RoHS Compliant: Yes; Contact Material: Copper Alloy; Housing Material: Polyester; Package Quantity: 11; Termination: PC Pins; ELV: Compliant; Packaging: Rail/Tube; Actuator Type: Rocker; Housing Color: Blue; Min Operating Temperature: -55°C; Max Operating Temperature: 105°C; Length: 27.43mm; Lead Free: Lead Free; Radiation Hardening: No; Series: 7100; Number of Positions: 10; Throw Configuration: SPST
U4-U13 = PC817X3NSZ1B: Optoisolator Transistor Output - 1 Channel 4-DIP; MF: Sharp Microelectronics; SnapEDA_Link: https://www.snapeda.com/parts/PC817X3NSZ1B/Sharp+Microelectronics/view-part/?ref=snap; Price: None; Purchase-URL: https://pricing.snapeda.com/search/part/PC817X3NSZ1B/?ref=eda; Check_prices: https://www.snapeda.com/parts/PC817X3NSZ1B/Sharp+Microelectronics/view-part/?ref=eda; MP: PC817X3NSZ1B; Value: *; Availability: In Stock; Package: DIP-4 Sharp Microelectronics

## Sheet DIGTITAL.SchDoc: DIGITAL
size 420 x 297 mm; Date: March 14; CheckedBy: ThS. Bùi Quốc Bảo; DrawnBy: Nguyễn Gia Huy; Revision: V1.0; SheetNumber: 5; SheetTotal: 11; MasterProject: STM32-PLC; Sub-system: DA1_prj.PrjPcb
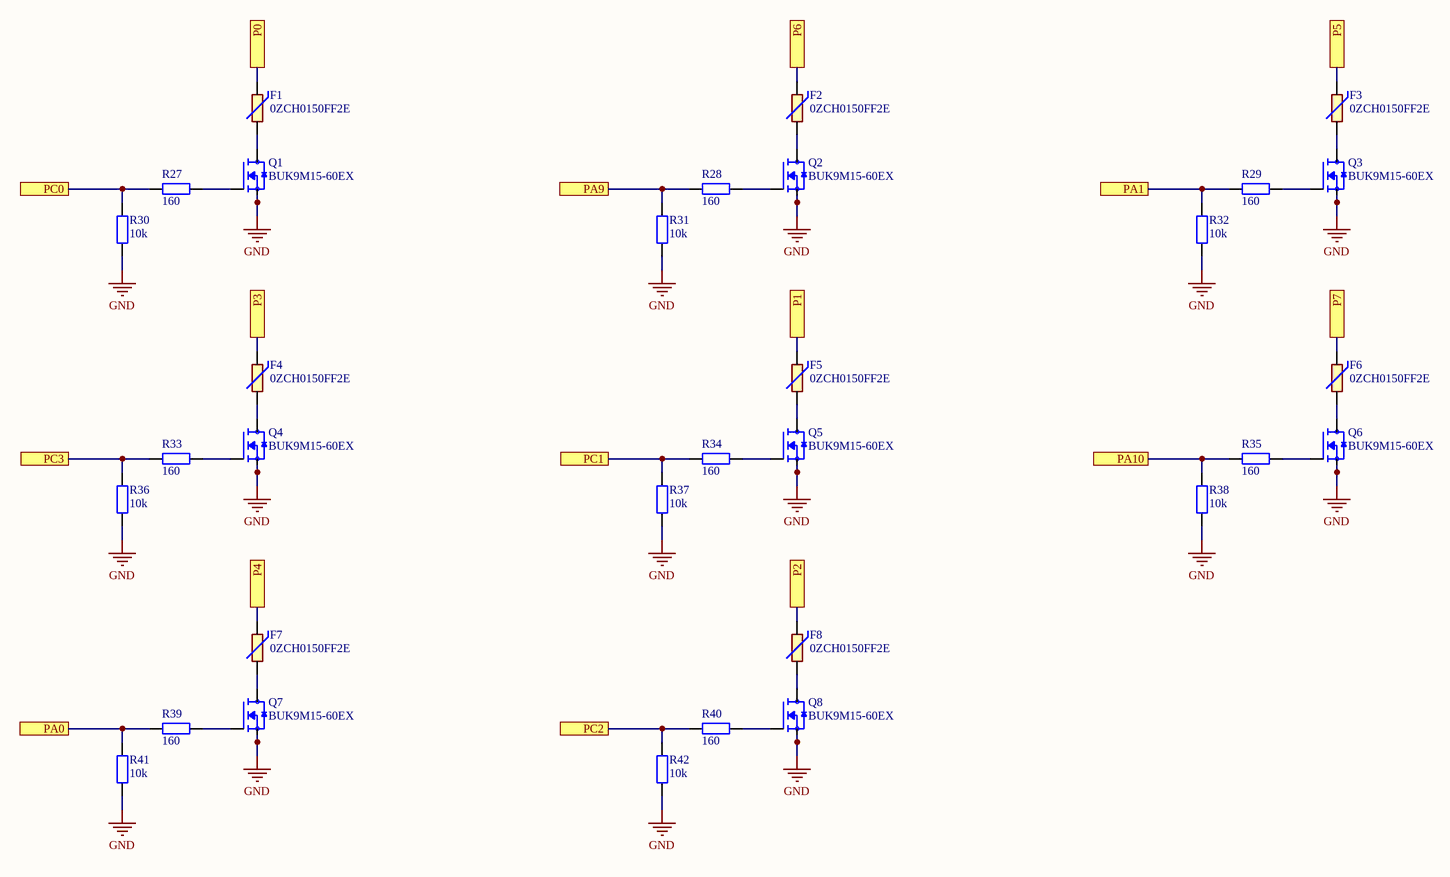
[diagram p4: DIGTITAL.SchDoc]

### Parts
F1  0ZCH0150FF2E  [FUSC3225X90N]
F2  0ZCH0150FF2E  [FUSC3225X90N]
F3  0ZCH0150FF2E  [FUSC3225X90N]
F4  0ZCH0150FF2E  [FUSC3225X90N]
F5  0ZCH0150FF2E  [FUSC3225X90N]
F6  0ZCH0150FF2E  [FUSC3225X90N]
F7  0ZCH0150FF2E  [FUSC3225X90N]
F8  0ZCH0150FF2E  [FUSC3225X90N]
Q1  BUK9M15-60EX  [TRANS_BUK9M15-60EX]
Q2  BUK9M15-60EX  [TRANS_BUK9M15-60EX]
Q3  BUK9M15-60EX  [TRANS_BUK9M15-60EX]
Q4  BUK9M15-60EX  [TRANS_BUK9M15-60EX]
Q5  BUK9M15-60EX  [TRANS_BUK9M15-60EX]
Q6  BUK9M15-60EX  [TRANS_BUK9M15-60EX]
Q7  BUK9M15-60EX  [TRANS_BUK9M15-60EX]
Q8  BUK9M15-60EX  [TRANS_BUK9M15-60EX]
R27  160  [tro smd 0603]
R28  160  [tro smd 0603]
R29  160  [tro smd 0603]
R30  10k  [tro smd 0603]
R31  10k  [tro smd 0603]
R32  10k  [tro smd 0603]
R33  160  [tro smd 0603]
R34  160  [tro smd 0603]
R35  160  [tro smd 0603]
R36  10k  [tro smd 0603]
R37  10k  [tro smd 0603]
R38  10k  [tro smd 0603]
R39  160  [tro smd 0603]
R40  160  [tro smd 0603]
R41  10k  [tro smd 0603]
R42  10k  [tro smd 0603]

### Ports
P0 (see STM32_PLC[2C]), P1 (see STM32_PLC[2C]), P2 (see STM32_PLC[2C]), P3 (see STM32_PLC[2C]), P4 (see STM32_PLC[2C]), P5 (see STM32_PLC[2D]), P6 (see STM32_PLC[2D]), P7 (see STM32_PLC[2D]), PA0 (see STM32_PLC[1B], STM32_PLC[3C]), PA1 (see STM32_PLC[1B], STM32_PLC[3D]), PA9 (see STM32_PLC[1B], STM32_PLC[3D]), PA10 (see STM32_PLC[2B], STM32_PLC[3D]), PC0 (see STM32_PLC[2B], STM32_PLC[3C]), PC1 (see STM32_PLC[2B], STM32_PLC[3C]), PC2 (see STM32_PLC[2B], STM32_PLC[3C]), PC3 (see STM32_PLC[2B], STM32_PLC[3C])

### Nets
GND: Q1.1(S) Q1.2(S) Q1.3(S) Q2.1(S) Q2.2(S) Q2.3(S) Q3.1(S) Q3.2(S) Q3.3(S) Q4.1(S) Q4.2(S) Q4.3(S) Q5.1(S) Q5.2(S) Q5.3(S) Q6.1(S) Q6.2(S) Q6.3(S) Q7.1(S) Q7.2(S) Q7.3(S) Q8.1(S) Q8.2(S) Q8.3(S) R30.1 R31.1 R32.1 R36.1 R37.1 R38.1 R41.1 R42.1
NetF1_1: F1.1 ; port P0
NetF1_2: F1.2 Q1.5(D)
NetF2_1: F2.1 ; port P6
NetF2_2: F2.2 Q2.5(D)
NetF3_1: F3.1 ; port P5
NetF3_2: F3.2 Q3.5(D)
NetF4_1: F4.1 ; port P3
NetF4_2: F4.2 Q4.5(D)
NetF5_1: F5.1 ; port P1
NetF5_2: F5.2 Q5.5(D)
NetF6_1: F6.1 ; port P7
NetF6_2: F6.2 Q6.5(D)
NetF7_1: F7.1 ; port P4
NetF7_2: F7.2 Q7.5(D)
NetF8_1: F8.1 ; port P2
NetF8_2: F8.2 Q8.5(D)
NetQ1_4: Q1.4(G) R27.2
NetQ2_4: Q2.4(G) R28.2
NetQ3_4: Q3.4(G) R29.2
NetQ4_4: Q4.4(G) R33.2
NetQ5_4: Q5.4(G) R34.2
NetQ6_4: Q6.4(G) R35.2
NetQ7_4: Q7.4(G) R39.2
NetQ8_4: Q8.4(G) R40.2
NetR27_1: R27.1 R30.2 ; port PC0
NetR28_1: R28.1 R31.2 ; port PA9
NetR29_1: R29.1 R32.2 ; port PA1
NetR33_1: R33.1 R36.2 ; port PC3
NetR34_1: R34.1 R37.2 ; port PC1
NetR35_1: R35.1 R38.2 ; port PA10
NetR39_1: R39.1 R41.2 ; port PA0
NetR40_1: R40.1 R42.2 ; port PC2

### Notes on the sheet
- Sub-system:
- Project:
- Design by:
- Sheet title:
- Sheet
- of
- Checked by:
- Approved by:
- Doc No:
- Revision:
- Size:
- Dates:
- A3

### Library data of the parts
F1-F8 = 0ZCH0150FF2E: 1210 SMT PPTC | 1.50 Ih | 6V; MF: Bel Fuse; SnapEDA_Link: https://www.snapeda.com/parts/0ZCH0150FF2E/Bel+Circuit+Protection/view-part/?ref=snap; Package: Package; Value: *; MP: 0ZCH0150FF2E; Check_prices: https://www.snapeda.com/parts/0ZCH0150FF2E/Bel+Circuit+Protection/view-part/?ref=eda
Q1-Q8 = BUK9M15-60EX: Bá»™ chuyá»ƒn Ä‘á»•i N-Channel 60 V 47A (Tc) 75W (Tc) gáº¯n bá» máº·t LFPAK33; MF: Nexperia USA; SnapEDA_Link: https://www.snapeda.com/parts/BUK9M15-60EX/Nexperia/view-part/?ref=snap; Package: LFPAK33-8 Nexperia USA Inc.; Value: *; MP: BUK9M15-60EX; Check_prices: https://www.snapeda.com/parts/BUK9M15-60EX/Nexperia/view-part/?ref=eda
R27-R42 = Tro 0603 1% 10k: as R1 on sheet STM32_PLC; Kieu_Chan: *

## Sheet DSDADC.SchDoc: DSDADC
size 420 x 297 mm; Date: March 14; CheckedBy: ThS. Bùi Quốc Bảo; DrawnBy: Nguyễn Gia Huy; Revision: V1.0; SheetNumber: 6; SheetTotal: 11; MasterProject: STM32-PLC; Sub-system: DA1_prj.PrjPcb
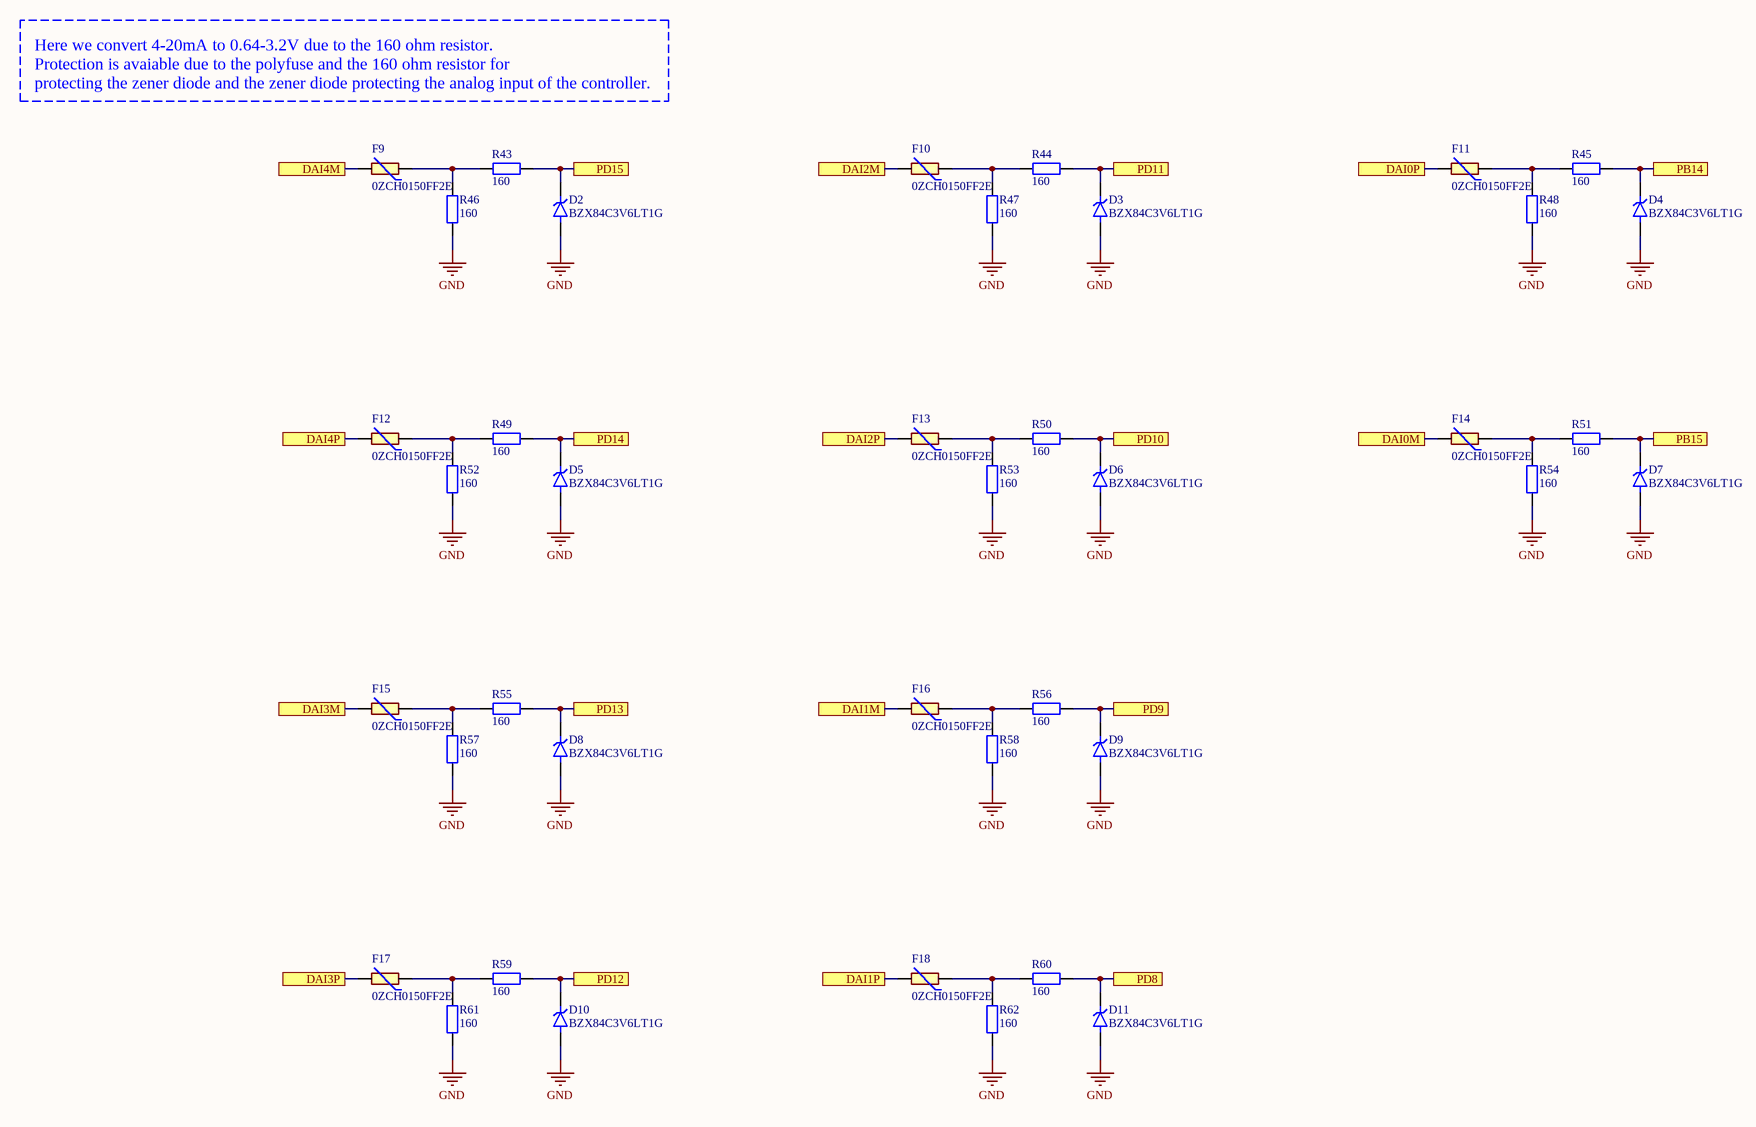
[diagram p5: DSDADC.SchDoc]

### Parts
D2  BZX84C3V6LT1G  [SOT95P240X111-3N]
D3  BZX84C3V6LT1G  [SOT95P240X111-3N]
D4  BZX84C3V6LT1G  [SOT95P240X111-3N]
D5  BZX84C3V6LT1G  [SOT95P240X111-3N]
D6  BZX84C3V6LT1G  [SOT95P240X111-3N]
D7  BZX84C3V6LT1G  [SOT95P240X111-3N]
D8  BZX84C3V6LT1G  [SOT95P240X111-3N]
D9  BZX84C3V6LT1G  [SOT95P240X111-3N]
D10  BZX84C3V6LT1G  [SOT95P240X111-3N]
D11  BZX84C3V6LT1G  [SOT95P240X111-3N]
F9  0ZCH0150FF2E  [FUSC3225X90N]
F10  0ZCH0150FF2E  [FUSC3225X90N]
F11  0ZCH0150FF2E  [FUSC3225X90N]
F12  0ZCH0150FF2E  [FUSC3225X90N]
F13  0ZCH0150FF2E  [FUSC3225X90N]
F14  0ZCH0150FF2E  [FUSC3225X90N]
F15  0ZCH0150FF2E  [FUSC3225X90N]
F16  0ZCH0150FF2E  [FUSC3225X90N]
F17  0ZCH0150FF2E  [FUSC3225X90N]
F18  0ZCH0150FF2E  [FUSC3225X90N]
R43  160  [tro smd 0603]
R44  160  [tro smd 0603]
R45  160  [tro smd 0603]
R46  160  [tro smd 0603]
R47  160  [tro smd 0603]
R48  160  [tro smd 0603]
R49  160  [tro smd 0603]
R50  160  [tro smd 0603]
R51  160  [tro smd 0603]
R52  160  [tro smd 0603]
R53  160  [tro smd 0603]
R54  160  [tro smd 0603]
R55  160  [tro smd 0603]
R56  160  [tro smd 0603]
R57  160  [tro smd 0603]
R58  160  [tro smd 0603]
R59  160  [tro smd 0603]
R60  160  [tro smd 0603]
R61  160  [tro smd 0603]
R62  160  [tro smd 0603]

### Ports
DAI0M (see STM32_PLC[4D]), DAI0P (see STM32_PLC[4D]), DAI1M (see STM32_PLC[4D]), DAI1P (see STM32_PLC[4D]), DAI2M (see STM32_PLC[4C]), DAI2P (see STM32_PLC[4D]), DAI3M (see STM32_PLC[4C]), DAI3P (see STM32_PLC[4C]), DAI4M (see STM32_PLC[4C]), DAI4P (see STM32_PLC[4C]), PB14 (see STM32_PLC[2B], STM32_PLC[4D]), PB15 (see STM32_PLC[2B], STM32_PLC[4D]), PD8 (see STM32_PLC[3C], STM32_PLC[4D]), PD9 (see STM32_PLC[3C], STM32_PLC[4D]), PD10 (see STM32_PLC[3C], STM32_PLC[4D]), PD11 (see STM32_PLC[3C], STM32_PLC[4C]), PD12 (see STM32_PLC[3C], STM32_PLC[4C]), PD13 (see STM32_PLC[3C], STM32_PLC[4C]), PD14 (see STM32_PLC[3C], STM32_PLC[4C]), PD15 (see STM32_PLC[3C], STM32_PLC[4C])

### Nets
GND: D2.1(A) D3.1(A) D4.1(A) D5.1(A) D6.1(A) D7.1(A) D8.1(A) D9.1(A) D10.1(A) D11.1(A) R46.1 R47.1 R48.1 R52.1 R53.1 R54.1 R57.1 R58.1 R61.1 R62.1
NetD2_3: D2.3(K) R43.2 ; port PD15
NetD3_3: D3.3(K) R44.2 ; port PD11
NetD4_3: D4.3(K) R45.2 ; port PB14
NetD5_3: D5.3(K) R49.2 ; port PD14
NetD6_3: D6.3(K) R50.2 ; port PD10
NetD7_3: D7.3(K) R51.2 ; port PB15
NetD8_3: D8.3(K) R55.2 ; port PD13
NetD9_3: D9.3(K) R56.2 ; port PD9
NetD10_3: D10.3(K) R59.2 ; port PD12
NetD11_3: D11.3(K) R60.2 ; port PD8
NetF9_1: F9.1 R43.1 R46.2
NetF9_2: F9.2 ; port DAI4M
NetF10_1: F10.1 R44.1 R47.2
NetF10_2: F10.2 ; port DAI2M
NetF11_1: F11.1 R45.1 R48.2
NetF11_2: F11.2 ; port DAI0P
NetF12_1: F12.1 R49.1 R52.2
NetF12_2: F12.2 ; port DAI4P
NetF13_1: F13.1 R50.1 R53.2
NetF13_2: F13.2 ; port DAI2P
NetF14_1: F14.1 R51.1 R54.2
NetF14_2: F14.2 ; port DAI0M
NetF15_1: F15.1 R55.1 R57.2
NetF15_2: F15.2 ; port DAI3M
NetF16_1: F16.1 R56.1 R58.2
NetF16_2: F16.2 ; port DAI1M
NetF17_1: F17.1 R59.1 R61.2
NetF17_2: F17.2 ; port DAI3P
NetF18_1: F18.1 R60.1 R62.2
NetF18_2: F18.2 ; port DAI1P

### Notes on the sheet
- Here we convert 4-20mA to 0.64-3.2V due to the 160 ohm resistor.
  Protection is avaiable due to the polyfuse and the 160 ohm resistor for
  protecting the zener diode and the zener diode protecting the analog input of the controller.
- Sub-system:
- Project:
- Design by:
- Sheet title:
- Sheet
- of
- Checked by:
- Approved by:
- Doc No:
- Revision:
- Size:
- Dates:
- A3

### Library data of the parts
F9-F18 = 0ZCH0150FF2E: as F1 on sheet DIGTITAL; SnapEDA_Link: https://www.snapeda.com/parts/0ZCH0150FF2E/Bel+Circuit+Protection/view-part/?ref=snap; Package: Package; Value: *; MP: 0ZCH0150FF2E; Check_prices: https://www.snapeda.com/parts/0ZCH0150FF2E/Bel+Circuit+Protection/view-part/?ref=eda
R43-R62 = Tro 0603 1% 10k: as R1 on sheet STM32_PLC; Kieu_Chan: *
D2-D11 = BZX84C3V6LT1G: Package: None; Price: None; Value: *; MP: BZX84C3V6LT1G; Availability: Unavailable

## Sheet PULSE.SchDoc: PULSE
size 420 x 297 mm; Date: March 14; CheckedBy: ThS. Bùi Quốc Bảo; DrawnBy: Nguyễn Gia Huy; Revision: V1.0; SheetNumber: 7; SheetTotal: 11; MasterProject: STM32-PLC; Sub-system: DA1_prj.PrjPcb
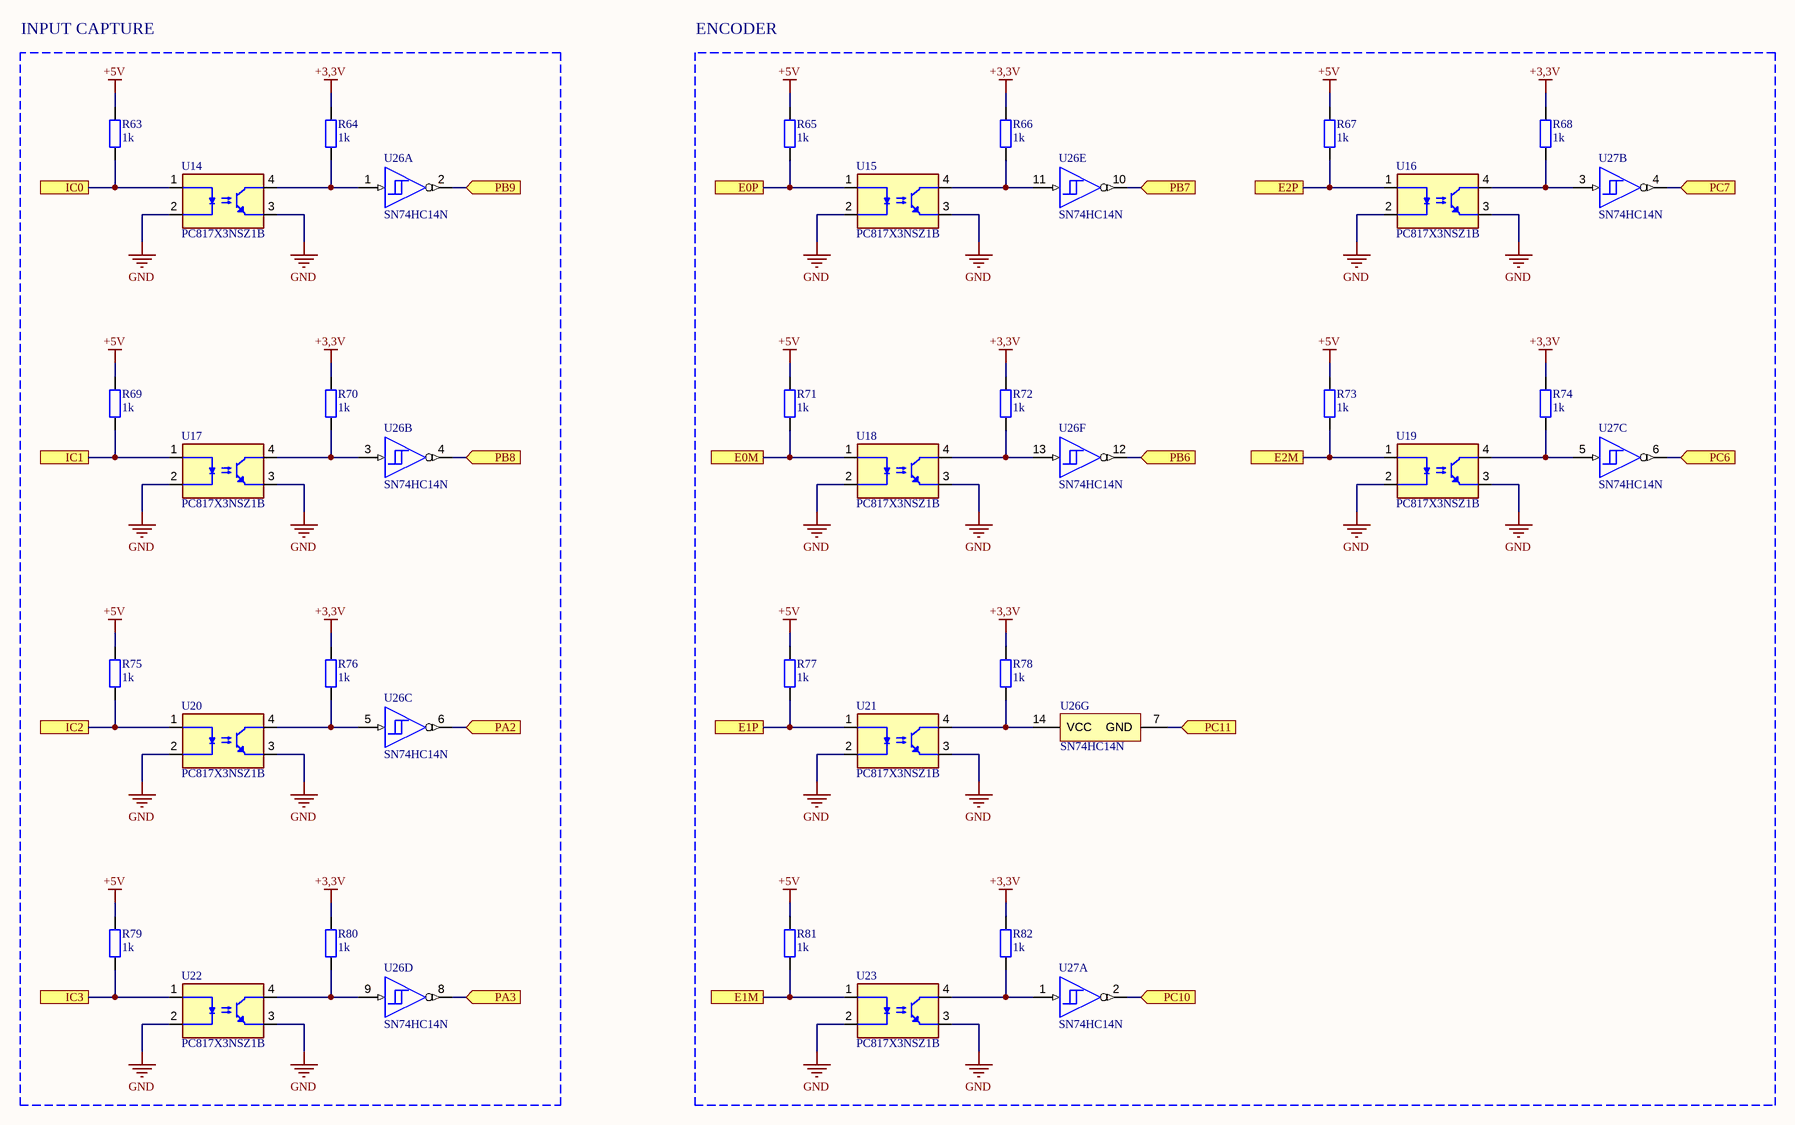
[diagram p6: PULSE.SchDoc]

### Parts
R63  1k  [tro smd 0603]
R64  1k  [tro smd 0603]
R65  1k  [tro smd 0603]
R66  1k  [tro smd 0603]
R67  1k  [tro smd 0603]
R68  1k  [tro smd 0603]
R69  1k  [tro smd 0603]
R70  1k  [tro smd 0603]
R71  1k  [tro smd 0603]
R72  1k  [tro smd 0603]
R73  1k  [tro smd 0603]
R74  1k  [tro smd 0603]
R75  1k  [tro smd 0603]
R76  1k  [tro smd 0603]
R77  1k  [tro smd 0603]
R78  1k  [tro smd 0603]
R79  1k  [tro smd 0603]
R80  1k  [tro smd 0603]
R81  1k  [tro smd 0603]
R82  1k  [tro smd 0603]
U14  PC817X3NSZ1B  [DIP762W50P254L495H455Q4]
U15  PC817X3NSZ1B  [DIP762W50P254L495H455Q4]
U16  PC817X3NSZ1B  [DIP762W50P254L495H455Q4]
U17  PC817X3NSZ1B  [DIP762W50P254L495H455Q4]
U18  PC817X3NSZ1B  [DIP762W50P254L495H455Q4]
U19  PC817X3NSZ1B  [DIP762W50P254L495H455Q4]
U20  PC817X3NSZ1B  [DIP762W50P254L495H455Q4]
U21  PC817X3NSZ1B  [DIP762W50P254L495H455Q4]
U22  PC817X3NSZ1B  [DIP762W50P254L495H455Q4]
U23  PC817X3NSZ1B  [DIP762W50P254L495H455Q4]
U26  SN74HC14N  [N0014A]  (parts A,B,C,D,E,F,G of 7)
U27  SN74HC14N  [N0014A]  (parts A,B,C of 7)

### Blocks framed on the sheet
INPUT CAPTURE: R63 R64 R69 R70 R75 R76 R79 R80 U14 U17 U20 U22 U26
ENCODER: R65-R68 R71-R74 R77 R78 R81 R82 U15 U16 U18 U19 U21 U23 U26 U27

### Ports
E0M (see STM32_PLC[5B]), E0P (see STM32_PLC[5B]), E1M (see STM32_PLC[5C]), E1P (see STM32_PLC[5B]), E2M (see STM32_PLC[5C]), E2P (see STM32_PLC[5C]), IC0 (see STM32_PLC[5B]), IC1 (see STM32_PLC[5B]), IC2 (see STM32_PLC[5B]), IC3 (see STM32_PLC[5B]), PA2 (in, see STM32_PLC[1B], STM32_PLC[6B]), PA3 (in, see STM32_PLC[1B], STM32_PLC[6B]), PB6 (in, see STM32_PLC[2B], STM32_PLC[6B]), PB7 (in, see STM32_PLC[2B], STM32_PLC[6B]), PB8 (in, see STM32_PLC[2B], STM32_PLC[6B]), PB9 (in, see STM32_PLC[2B], STM32_PLC[6B]), PC6 (in, see STM32_PLC[2B], STM32_PLC[6C]), PC7 (in, see STM32_PLC[3B], STM32_PLC[6C]), PC10 (in, see STM32_PLC[3B], STM32_PLC[6C]), PC11 (in, see STM32_PLC[3B], STM32_PLC[6B])

### Nets
+3,3V: R64.2 R66.2 R68.2 R70.2 R72.2 R74.2 R76.2 R78.2 R80.2 R82.2
+5V: R63.2 R65.2 R67.2 R69.2 R71.2 R73.2 R75.2 R77.2 R79.2 R81.2
GND: U14.2(CATHODE) U14.3(EMITTER) U15.2(CATHODE) U15.3(EMITTER) U16.2(CATHODE) U16.3(EMITTER) U17.2(CATHODE) U17.3(EMITTER) U18.2(CATHODE) U18.3(EMITTER) U19.2(CATHODE) U19.3(EMITTER) U20.2(CATHODE) U20.3(EMITTER) U21.2(CATHODE) U21.3(EMITTER) U22.2(CATHODE) U22.3(EMITTER) U23.2(CATHODE) U23.3(EMITTER)
NetP1_1: R79.1 U22.1(ANODE) ; port IC3
NetP1_2: R75.1 U20.1(ANODE) ; port IC2
NetP1_3: R69.1 U17.1(ANODE) ; port IC1
NetP1_4: R63.1 U14.1(ANODE) ; port IC0
NetP7_1: R73.1 U19.1(ANODE) ; port E2M
NetP7_2: R67.1 U16.1(ANODE) ; port E2P
NetP7_3: R81.1 U23.1(ANODE) ; port E1M
NetP7_4: R77.1 U21.1(ANODE) ; port E1P
NetP7_5: R71.1 U18.1(ANODE) ; port E0M
NetP7_6: R65.1 U15.1(ANODE) ; port E0P
NetR64_1: R64.1 U14.4(COLLECTOR) U26.1(1A)
NetR66_1: R66.1 U15.4(COLLECTOR) U26.11(5A)
NetR68_1: R68.1 U16.4(COLLECTOR) U27.3(2A)
NetR70_1: R70.1 U17.4(COLLECTOR) U26.3(2A)
NetR72_1: R72.1 U18.4(COLLECTOR) U26.13(6A)
NetR74_1: R74.1 U19.4(COLLECTOR) U27.5(3A)
NetR76_1: R76.1 U20.4(COLLECTOR) U26.5(3A)
NetR78_1: R78.1 U21.4(COLLECTOR) U26.14(VCC)
NetR80_1: R80.1 U22.4(COLLECTOR) U26.9(4A)
NetR82_1: R82.1 U23.4(COLLECTOR) U27.1(1A)
NetU2_25: U26.6(~{3Y}) ; port PA2
NetU2_26: U26.8(~{4Y}) ; port PA3
NetU2_63: U27.6(~{3Y}) ; port PC6
NetU2_64: U27.4(~{2Y}) ; port PC7
NetU2_78: U27.2(~{1Y}) ; port PC10
NetU2_79: U26.7(GND) ; port PC11
NetU2_92: U26.12(~{6Y}) ; port PB6
NetU2_93: U26.10(~{5Y}) ; port PB7
NetU2_95: U26.4(~{2Y}) ; port PB8
NetU2_96: U26.2(~{1Y}) ; port PB9

### Notes on the sheet
- Sub-system:
- Project:
- Design by:
- Sheet title:
- Sheet
- of
- Checked by:
- Approved by:
- Doc No:
- Revision:
- Size:
- Dates:
- A3

### Library data of the parts
R63-R82 = Tro 0603 1% 10k: as R1 on sheet STM32_PLC; Kieu_Chan: *
U14-U23 = PC817X3NSZ1B: as U4 on sheet INPUT; SnapEDA_Link: https://www.snapeda.com/parts/PC817X3NSZ1B/Sharp+Microelectronics/view-part/?ref=snap; Price: None; Purchase-URL: https://pricing.snapeda.com/search/part/PC817X3NSZ1B/?ref=eda; Check_prices: https://www.snapeda.com/parts/PC817X3NSZ1B/Sharp+Microelectronics/view-part/?ref=eda; MP: PC817X3NSZ1B; Value: *; Availability: In Stock; Package: DIP-4 Sharp Microelectronics
U26 U27 = CMP-1615-00889-3: Hex Schmitt-Trigger Inverters, N0014A, TUBE; Manufacturer: Texas Instruments; Input Type: CMOS; Voltage(Nom)(V): 5; VCC(Min)(V): 2; tpd @ Nom Voltage(Max)(ns): 31; Technology Family: HC; VCC(Max)(V): 6; F @ Nom Voltage(Max)(Mhz): 20; Output Drive (IOL/IOH)(Max)(mA): -4/4; Rating: Catalog; Schmitt Trigger: Yes; ICC @ Nom Voltage(Max)(mA): 0.02; PackageReference: N0014A; Code_JEDEC: MS-001; Operating Temperature Range(C): -40 to 85; Generic Part Number: SN74HC14; Bits(#): 6; DatasheetVersion: SCLS085G; Output Type: CMOS

## Sheet CAN.SchDoc: CAN
size 420 x 297 mm; Date: March 14; CheckedBy: ThS. Bùi Quốc Bảo; DrawnBy: Nguyễn Gia Huy; Revision: V1.0; SheetNumber: 8; SheetTotal: 11; MasterProject: STM32-PLC; Sub-system: DA1_prj.PrjPcb
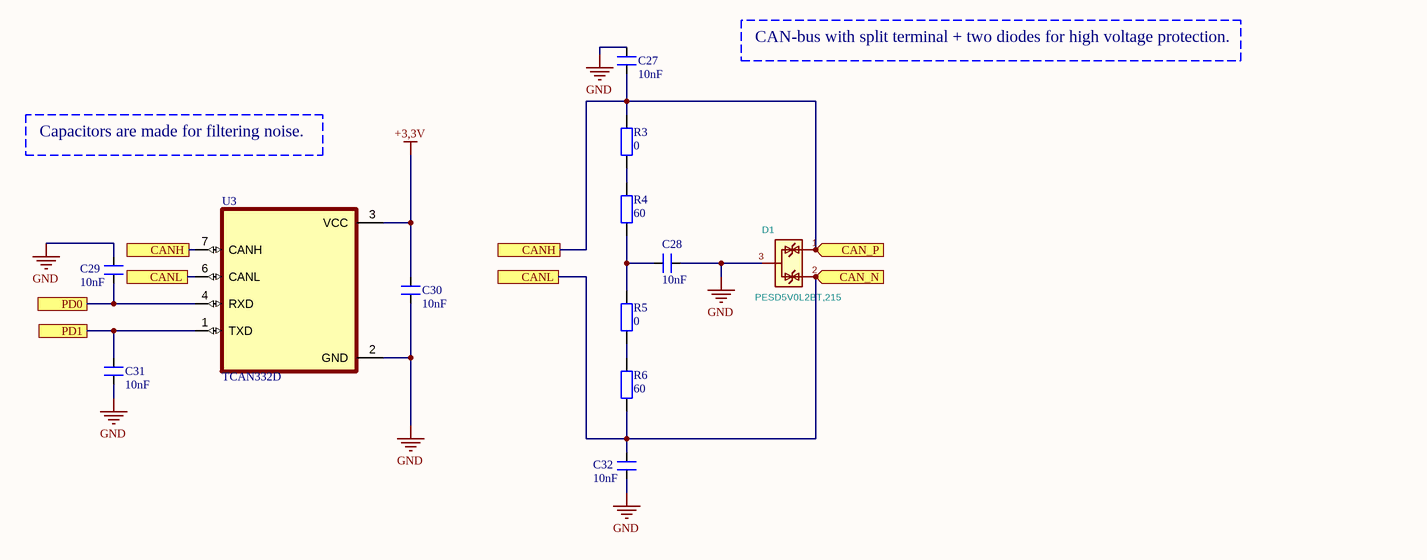
[diagram p7: CAN.SchDoc]

### Parts
C27  10nF  [FP-C0603C-CF-IPC_A]
C28  10nF  [FP-C0603C-CF-IPC_A]
C29  10nF  [FP-C0603C-CF-IPC_A]
C30  10nF  [FP-C0603C-CF-IPC_A]
C31  10nF  [FP-C0603C-CF-IPC_A]
C32  10nF  [FP-C0603C-CF-IPC_A]
D1  PESD5V0L2BT,215  [SOT95P230X110-3N]
R3  0  [tro smd 0603]
R4  60  [tro smd 0603]
R5  0  [tro smd 0603]
R6  60  [tro smd 0603]
U3  TCAN332D  [SOIC127P599X175-8N]

### Ports
CAN_N (in, see STM32_PLC[6B]), CAN_P (in, see STM32_PLC[6B]), CANH (see CAN[2B]), CANH (see CAN[3B]), CANL (see CAN[2B]), CANL (see CAN[3B]), PD0 (see STM32_PLC[2C], STM32_PLC[6B]), PD1 (see STM32_PLC[2C], STM32_PLC[6B])

### Nets
+3,3V: C30.2 U3.3(VCC)
GND: C27.1 C28.1 C29.2 C30.1 C31.1 C32.1 D1.3(A) U3.2(GND)
NetC27_2: C27.2 D1.1(K) R3.2 U3.7(CANH) ; port CANH, port CAN_P
NetC28_2: C28.2 R4.1 R5.2
NetC29_1: C29.1 U3.4(RXD) ; port PD0
NetC31_2: C31.2 U3.1(TXD) ; port PD1
NetC32_2: C32.2 D1.2(K) R6.1 U3.6(CANL) ; port CANL, port CAN_N
NetR3_1: R3.1 R4.2
NetR5_1: R5.1 R6.2

### Notes on the sheet
- CAN-bus with split terminal + two diodes for high voltage protection.
- Capacitors are made for filtering noise.
- Sub-system:
- Project:
- Design by:
- Sheet title:
- Sheet
- of
- Checked by:
- Approved by:
- Doc No:
- Revision:
- Size:
- Dates:
- A3

### Library data of the parts
C27-C32 = CN-SEMI-DIP: as C1 on sheet STM32_PLC; LatestRevisionDate: 17-Jul-2002; LatestRevisionNote: Re-released for DXP Platform.; PackageReference: C1206; Publisher: Altium Limited
D1 = NUP2105L: Mouser Eletronics: 755-MMBZ6V8ALFHT116; Value: PESD5V0L2BT,215; Footprint: Package_TO_SOT_SMD:SOT-23
R3-R6 = Tro 0603 1% 10k: as R1 on sheet STM32_PLC; Kieu_Chan: *
U3 = TCAN332D: 3.3-V CAN Transceivers; MF: Texas Instruments; SnapEDA_Link: https://www.snapeda.com/parts/TCAN332D/Texas+Instruments/view-part/?ref=snap; Package: SOIC-8 Texas Instruments; Value: *; MP: TCAN332D; Check_prices: https://www.snapeda.com/parts/TCAN332D/Texas+Instruments/view-part/?ref=eda

## Sheet SDADC.SchDoc: SDADC
size 420 x 297 mm; Date: March 14; CheckedBy: ThS. Bùi Quốc Bảo; DrawnBy: Nguyễn Gia Huy; Revision: V1.0; SheetNumber: 9; SheetTotal: 11; MasterProject: STM32-PLC; Sub-system: DA1_prj.PrjPcb
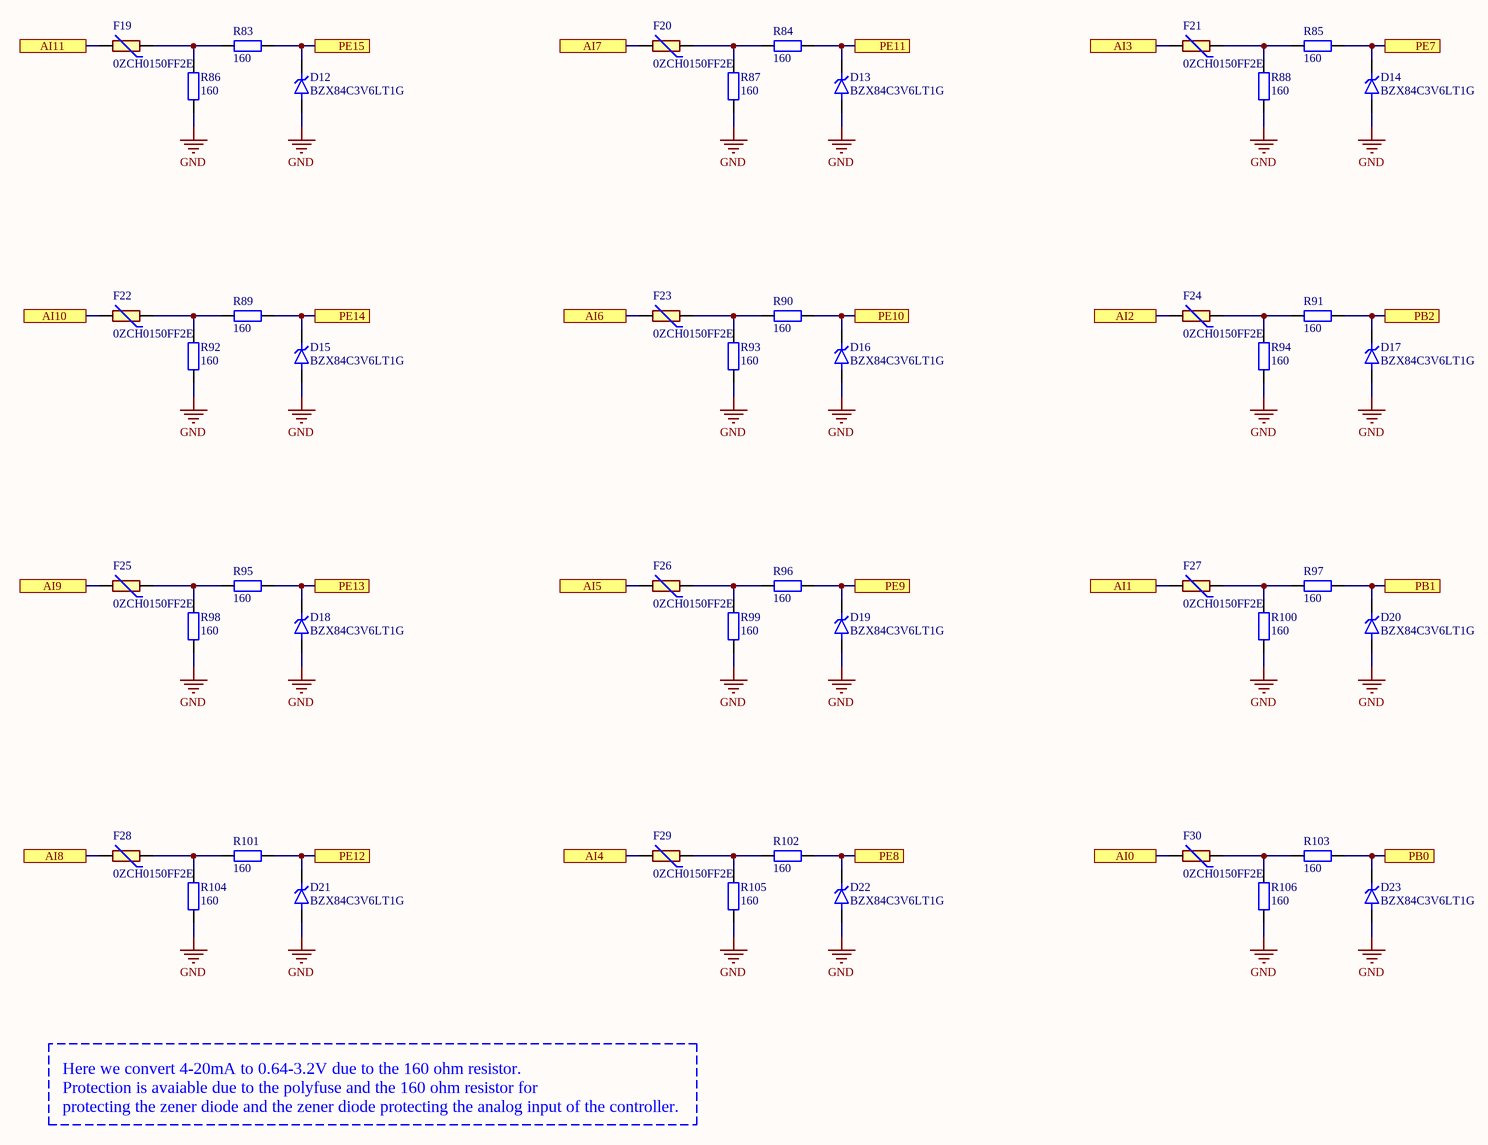
[diagram p8: SDADC.SchDoc]

### Parts
D12  BZX84C3V6LT1G  [SOT95P240X111-3N]
D13  BZX84C3V6LT1G  [SOT95P240X111-3N]
D14  BZX84C3V6LT1G  [SOT95P240X111-3N]
D15  BZX84C3V6LT1G  [SOT95P240X111-3N]
D16  BZX84C3V6LT1G  [SOT95P240X111-3N]
D17  BZX84C3V6LT1G  [SOT95P240X111-3N]
D18  BZX84C3V6LT1G  [SOT95P240X111-3N]
D19  BZX84C3V6LT1G  [SOT95P240X111-3N]
D20  BZX84C3V6LT1G  [SOT95P240X111-3N]
D21  BZX84C3V6LT1G  [SOT95P240X111-3N]
D22  BZX84C3V6LT1G  [SOT95P240X111-3N]
D23  BZX84C3V6LT1G  [SOT95P240X111-3N]
F19  0ZCH0150FF2E  [FUSC3225X90N]
F20  0ZCH0150FF2E  [FUSC3225X90N]
F21  0ZCH0150FF2E  [FUSC3225X90N]
F22  0ZCH0150FF2E  [FUSC3225X90N]
F23  0ZCH0150FF2E  [FUSC3225X90N]
F24  0ZCH0150FF2E  [FUSC3225X90N]
F25  0ZCH0150FF2E  [FUSC3225X90N]
F26  0ZCH0150FF2E  [FUSC3225X90N]
F27  0ZCH0150FF2E  [FUSC3225X90N]
F28  0ZCH0150FF2E  [FUSC3225X90N]
F29  0ZCH0150FF2E  [FUSC3225X90N]
F30  0ZCH0150FF2E  [FUSC3225X90N]
R83  160  [tro smd 0603]
R84  160  [tro smd 0603]
R85  160  [tro smd 0603]
R86  160  [tro smd 0603]
R87  160  [tro smd 0603]
R88  160  [tro smd 0603]
R89  160  [tro smd 0603]
R90  160  [tro smd 0603]
R91  160  [tro smd 0603]
R92  160  [tro smd 0603]
R93  160  [tro smd 0603]
R94  160  [tro smd 0603]
R95  160  [tro smd 0603]
R96  160  [tro smd 0603]
R97  160  [tro smd 0603]
R98  160  [tro smd 0603]
R99  160  [tro smd 0603]
R100  160  [tro smd 0603]
R101  160  [tro smd 0603]
R102  160  [tro smd 0603]
R103  160  [tro smd 0603]
R104  160  [tro smd 0603]
R105  160  [tro smd 0603]
R106  160  [tro smd 0603]

### Ports
AI0 (see STM32_PLC[4C]), AI1 (see STM32_PLC[4C]), AI2 (see STM32_PLC[4C]), AI3 (see STM32_PLC[4B]), AI4 (see STM32_PLC[4B]), AI5 (see STM32_PLC[4B]), AI6 (see STM32_PLC[4B]), AI7 (see STM32_PLC[4B]), AI8 (see STM32_PLC[4B]), AI9 (see STM32_PLC[4B]), AI10 (see STM32_PLC[4B]), AI11 (see STM32_PLC[4B]), PB0 (see STM32_PLC[2B], STM32_PLC[4C], STM32_PLC[5C]), PB1 (see STM32_PLC[2B], STM32_PLC[4C], STM32_PLC[5C]), PB2 (see STM32_PLC[2B], STM32_PLC[4C], STM32_PLC[5C]), PE7 (see STM32_PLC[2C], STM32_PLC[4B], STM32_PLC[5B]), PE8 (see STM32_PLC[2C], STM32_PLC[4B], STM32_PLC[5B]), PE9 (see STM32_PLC[2C], STM32_PLC[4B], STM32_PLC[5B]), PE10 (see STM32_PLC[2C], STM32_PLC[4B], STM32_PLC[5B]), PE11 (see STM32_PLC[2C], STM32_PLC[4B], STM32_PLC[5B]), PE12 (see STM32_PLC[2C], STM32_PLC[4B], STM32_PLC[5B]), PE13 (see STM32_PLC[2C], STM32_PLC[4B], STM32_PLC[5B]), PE14 (see STM32_PLC[2C], STM32_PLC[4B], STM32_PLC[5B]), PE15 (see STM32_PLC[2C], STM32_PLC[4B], STM32_PLC[5B])

### Nets
GND: D12.1(A) D13.1(A) D14.1(A) D15.1(A) D16.1(A) D17.1(A) D18.1(A) D19.1(A) D20.1(A) D21.1(A) D22.1(A) D23.1(A) R86.1 R87.1 R88.1 R92.1 R93.1 R94.1 R98.1 R99.1 R100.1 R104.1 R105.1 R106.1
NetD12_3: D12.3(K) R83.2 ; port PE15
NetD13_3: D13.3(K) R84.2 ; port PE11
NetD14_3: D14.3(K) R85.2 ; port PE7
NetD15_3: D15.3(K) R89.2 ; port PE14
NetD16_3: D16.3(K) R90.2 ; port PE10
NetD17_3: D17.3(K) R91.2 ; port PB2
NetD18_3: D18.3(K) R95.2 ; port PE13
NetD19_3: D19.3(K) R96.2 ; port PE9
NetD20_3: D20.3(K) R97.2 ; port PB1
NetD21_3: D21.3(K) R101.2 ; port PE12
NetD22_3: D22.3(K) R102.2 ; port PE8
NetD23_3: D23.3(K) R103.2 ; port PB0
NetF19_1: F19.1 R83.1 R86.2
NetF19_2: F19.2 ; port AI11
NetF20_1: F20.1 R84.1 R87.2
NetF20_2: F20.2 ; port AI7
NetF21_1: F21.1 R85.1 R88.2
NetF21_2: F21.2 ; port AI3
NetF22_1: F22.1 R89.1 R92.2
NetF22_2: F22.2 ; port AI10
NetF23_1: F23.1 R90.1 R93.2
NetF23_2: F23.2 ; port AI6
NetF24_1: F24.1 R91.1 R94.2
NetF24_2: F24.2 ; port AI2
NetF25_1: F25.1 R95.1 R98.2
NetF25_2: F25.2 ; port AI9
NetF26_1: F26.1 R96.1 R99.2
NetF26_2: F26.2 ; port AI5
NetF27_1: F27.1 R97.1 R100.2
NetF27_2: F27.2 ; port AI1
NetF28_1: F28.1 R101.1 R104.2
NetF28_2: F28.2 ; port AI8
NetF29_1: F29.1 R102.1 R105.2
NetF29_2: F29.2 ; port AI4
NetF30_1: F30.1 R103.1 R106.2
NetF30_2: F30.2 ; port AI0

### Notes on the sheet
- Here we convert 4-20mA to 0.64-3.2V due to the 160 ohm resistor.
  Protection is avaiable due to the polyfuse and the 160 ohm resistor for
  protecting the zener diode and the zener diode protecting the analog input of the controller.
- Sub-system:
- Project:
- Design by:
- Sheet title:
- Sheet
- of
- Checked by:
- Approved by:
- Doc No:
- Revision:
- Size:
- Dates:
- A3

### Library data of the parts
F19-F30 = 0ZCH0150FF2E: as F1 on sheet DIGTITAL; SnapEDA_Link: https://www.snapeda.com/parts/0ZCH0150FF2E/Bel+Circuit+Protection/view-part/?ref=snap; Package: Package; Value: *; MP: 0ZCH0150FF2E; Check_prices: https://www.snapeda.com/parts/0ZCH0150FF2E/Bel+Circuit+Protection/view-part/?ref=eda
R83-R106 = Tro 0603 1% 10k: as R1 on sheet STM32_PLC; Kieu_Chan: *
D12-D23 = BZX84C3V6LT1G: Package: None; Price: None; Value: *; MP: BZX84C3V6LT1G; Availability: Unavailable